# EAGLE design TINRS - Wobbler (third batch) (EAGLE 7.7.0)

## Sheet 1 of 5: MCU & Eeprom
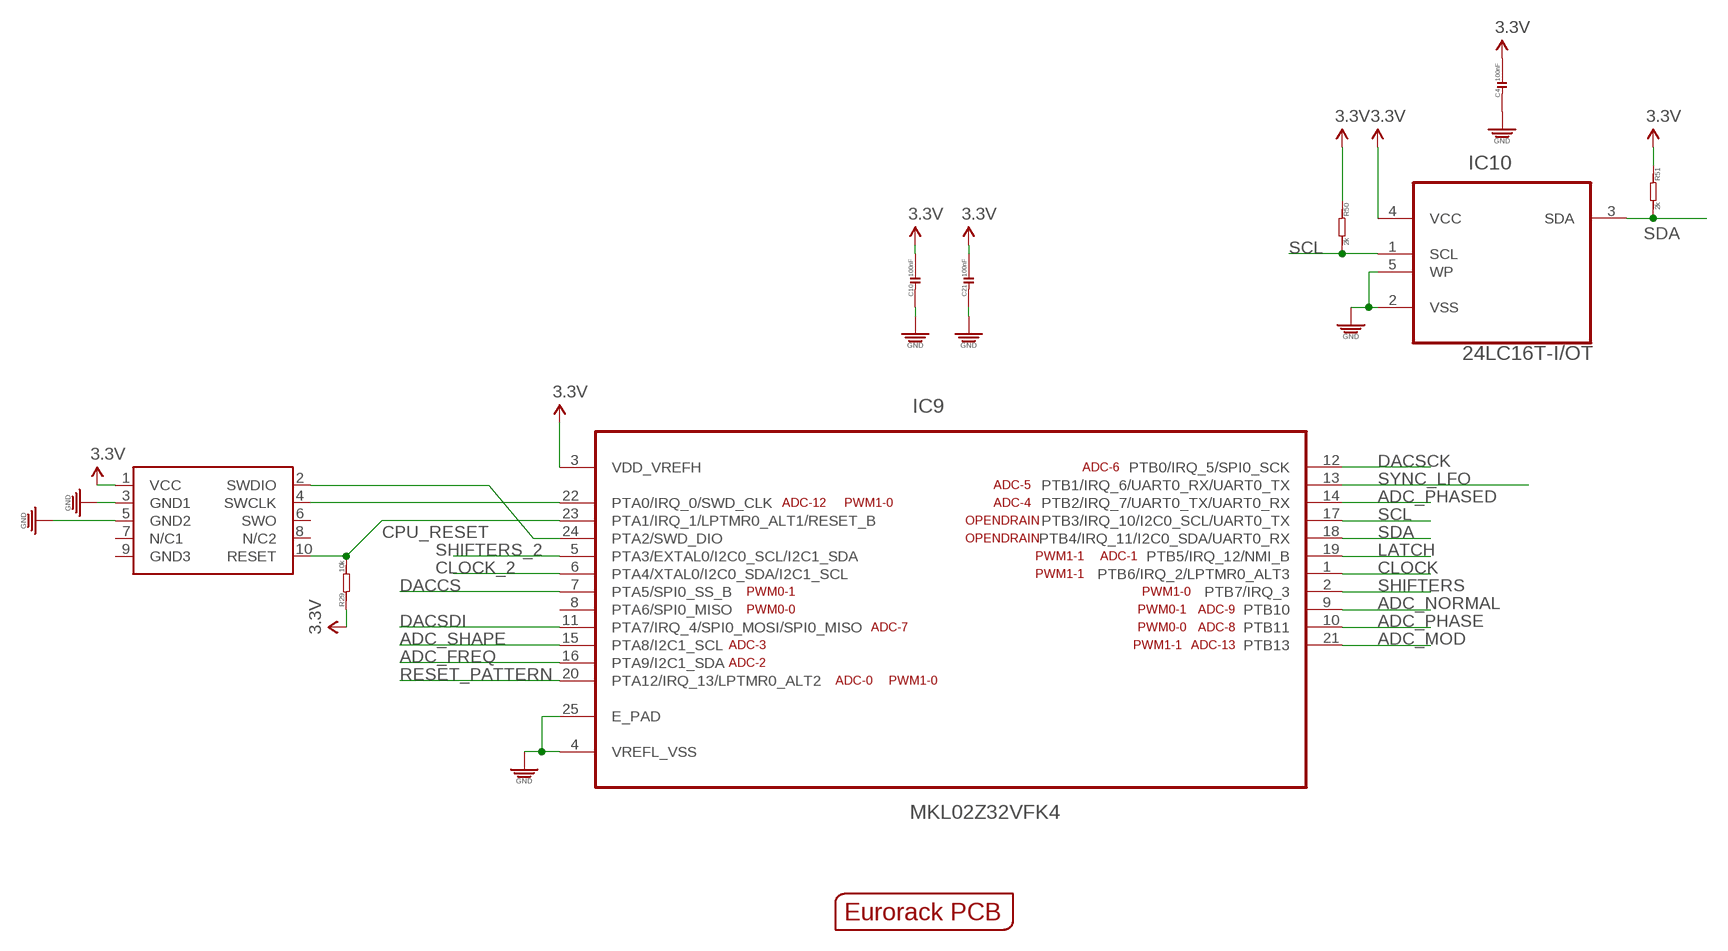
[diagram p0: schematic, sheet 1]

### Parts
C4  100nF  C-0603  [C0603]
C10  100nF  C-0603  [C0603]
C21  100nF  C-0603  [C0603]
IC9  MKL02Z32VFK4  [QFN50P400X400X100-25N]
IC10  24LC16T-I/OT  24LC00T-I/OT  [SOT95P290X145-5N]
OUTLINE  EURORACK_PCB12HP  [EURORACK12HPPCB]
R29  10k  R-0603  [R0603]
R50  2k  R-0603  [R0603]
R51  2k  R-0603  [R0603]
SWD1  CORTEX_SWD  [M50-3600542]

### Nets
3.3V [heavypower]: C4.2 C10.2 C21.2 IC9.3(VDD_VREFH) IC10.4(VCC) R29.1 R50.1 R51.1 SWD1.1(VCC) ; also sheet 2,3,4,5
ADC_FREQ: IC9.16(PTA9/I2C1_SDA) ; also sheet 5
ADC_MOD: IC9.21(PTB13) ; also sheet 5
ADC_NORMAL: IC9.9(PTB10) ; also sheet 5
ADC_PHASE: IC9.10(PTB11) ; also sheet 5
ADC_PHASED: IC9.14(PTB2/IRQ_7/UART0_TX/UART0_RX) ; also sheet 5
ADC_SHAPE: IC9.15(PTA8/I2C1_SCL) ; also sheet 5
CLOCK: IC9.1(PTB6/IRQ_2/LPTMR0_ALT3) ; also sheet 2
CLOCK_2: IC9.6(PTA4/XTAL0/I2C0_SDA/I2C1_SCL) ; also sheet 2
CPU_RESET: IC9.23(PTA1/IRQ_1/LPTMR0_ALT1/RESET_B) R29.2 SWD1.10(RESET)
DACCS: IC9.7(PTA5/SPI0_SS_B) ; also sheet 3
DACSCK: IC9.12(PTB0/IRQ_5/SPI0_SCK) ; also sheet 3
DACSDI: IC9.11(PTA7/IRQ_4/SPI0_MOSI/SPI0_MISO) ; also sheet 3
GND [groundplane]: C4.1 C10.1 C21.1 IC9.4(VREFL_VSS) IC9.25(E_PAD) IC10.2(VSS) IC10.5(WP) SWD1.3(GND1) SWD1.5(GND2) ; also sheet 2,3,4,5
LATCH: IC9.19(PTB5/IRQ_12/NMI_B) ; also sheet 2
RESET_PATTERN: IC9.20(PTA12/IRQ_13/LPTMR0_ALT2) ; also sheet 2,5
SCL: IC9.17(PTB3/IRQ_10/I2C0_SCL/UART0_TX) IC10.1(SCL) R50.2
SDA: IC9.18(PTB4/IRQ_11/I2C0_SDA/UART0_RX) IC10.3(SDA) R51.2
SHIFTERS: IC9.2(PTB7/IRQ_3) ; also sheet 2
SHIFTERS_2: IC9.5(PTA3/EXTAL0/I2C0_SCL/I2C1_SDA) ; also sheet 2
SWD_CLK: IC9.22(PTA0/IRQ_0/SWD_CLK) SWD1.4(SWCLK)
SWD_DIO: IC9.24(PTA2/SWD_DIO) SWD1.2(SWDIO)
SYNC_LFO: IC9.13(PTB1/IRQ_6/UART0_RX/UART0_TX) ; also sheet 5
Unconnected: IC9.8(PTA6/SPI0_MISO) SWD1.6(SWO) SWD1.7(N/C1) SWD1.8(N/C2) SWD1.9(GND3)

## Sheet 2 of 5: LEDs & button
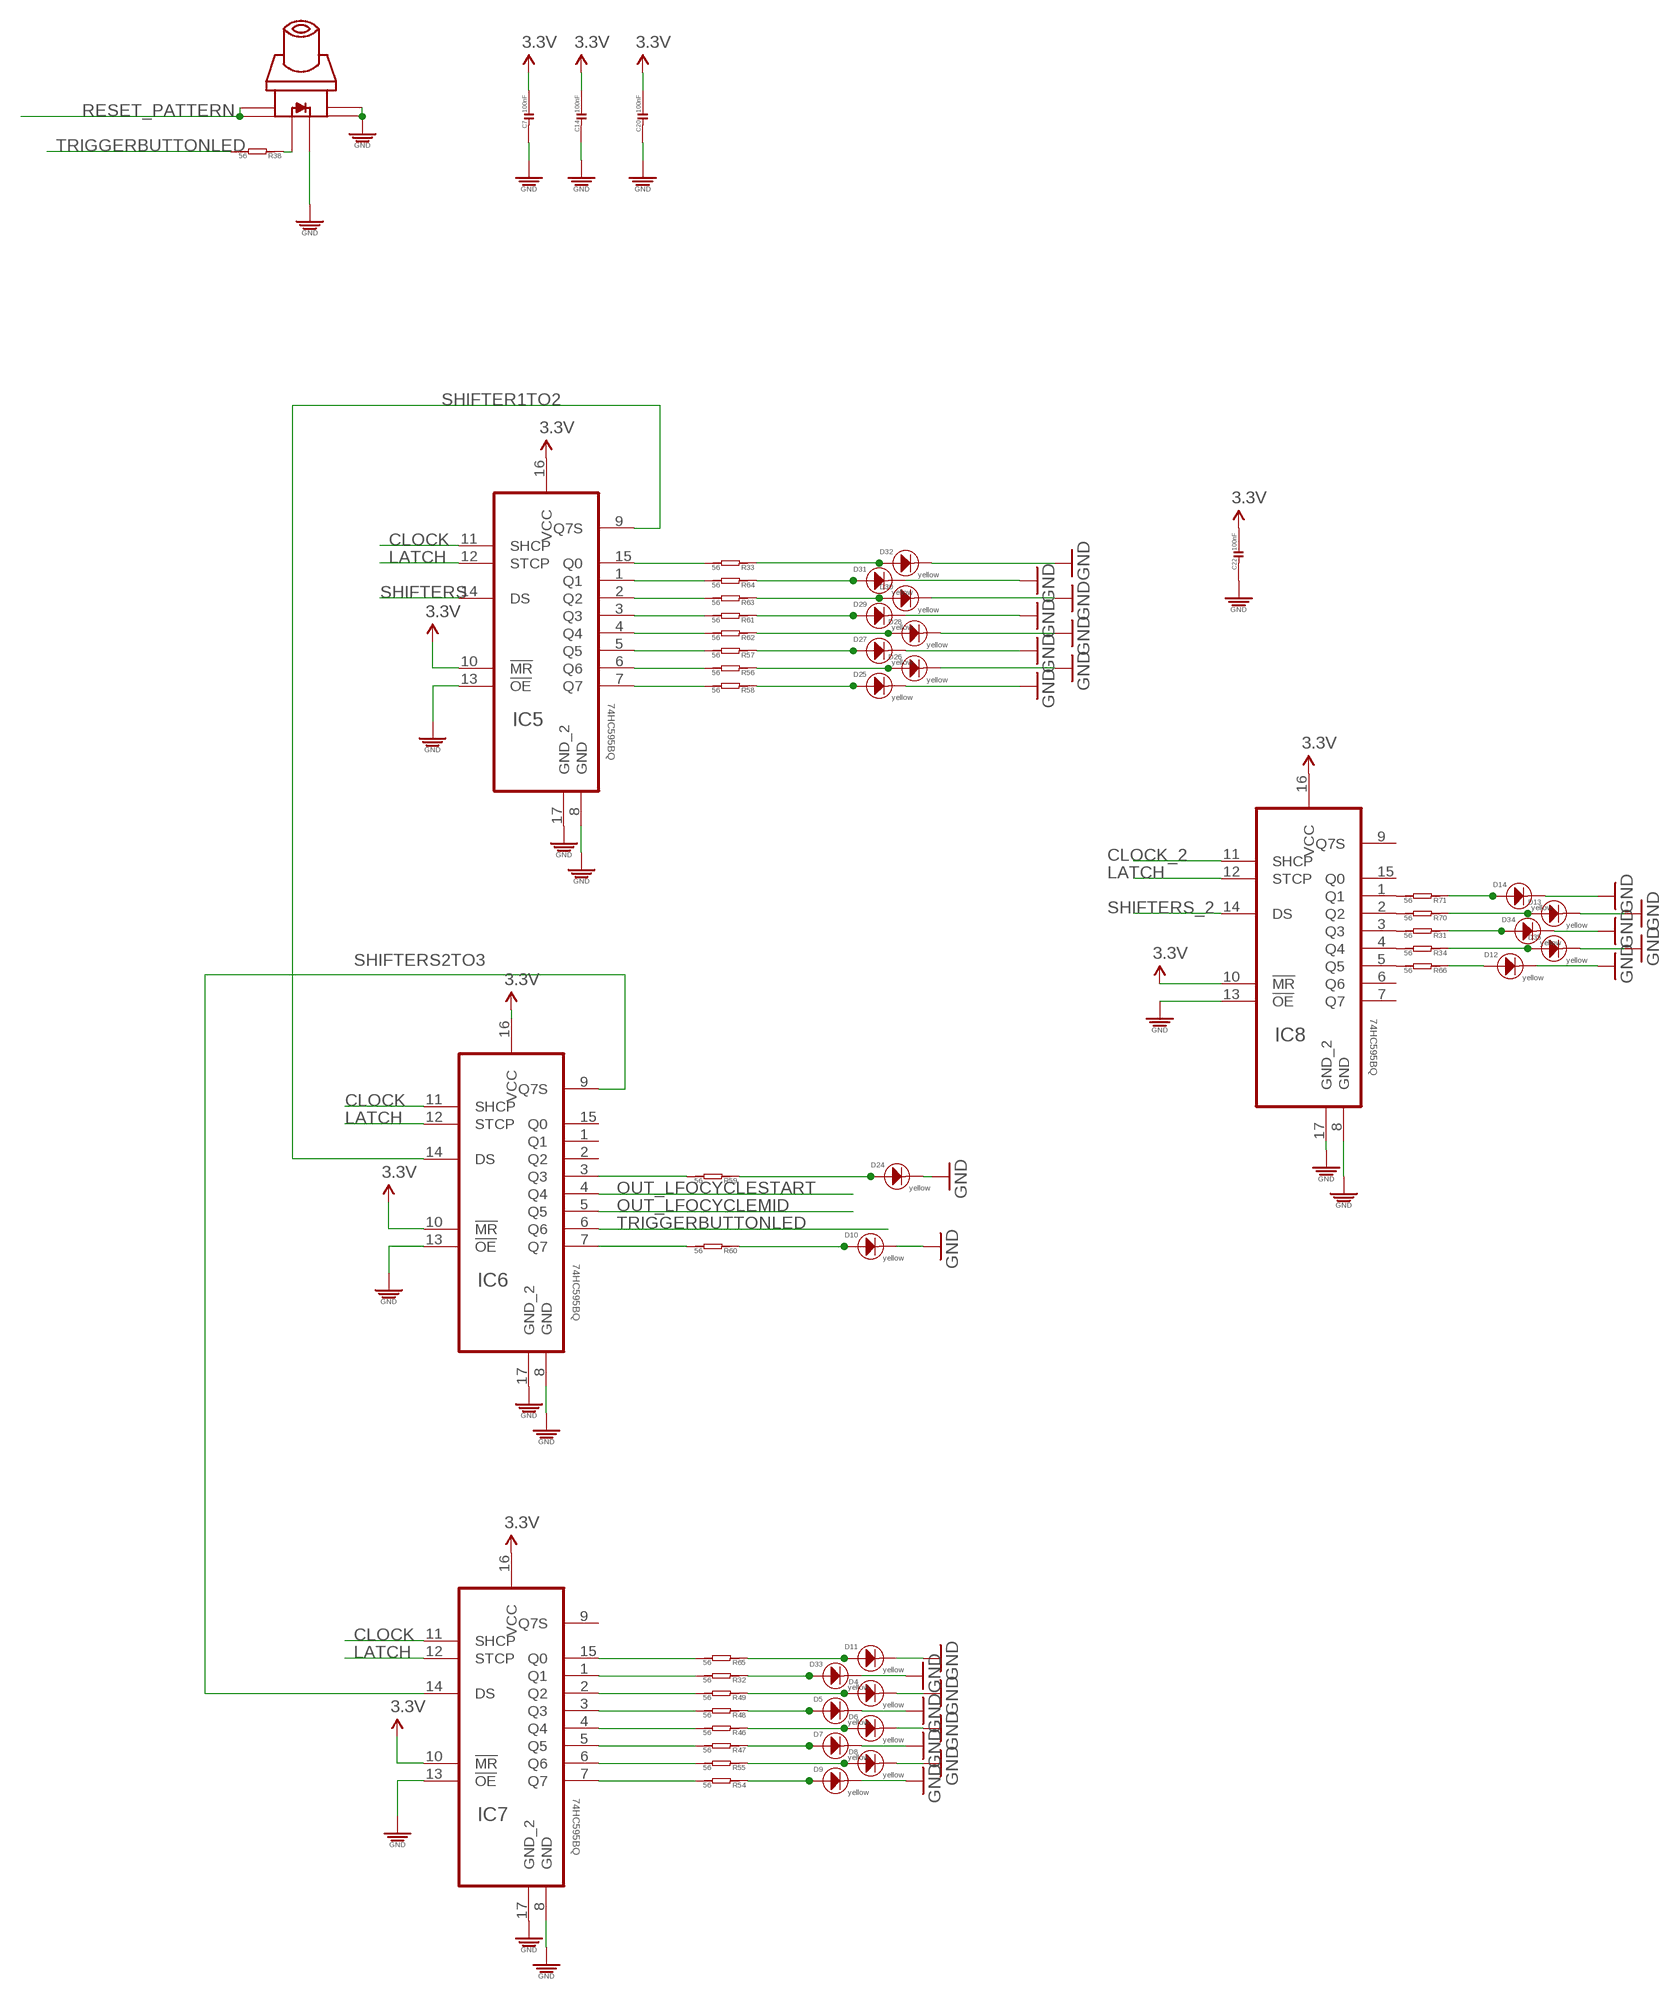
[diagram p1: schematic, sheet 2]

### Parts
C7  100nF  C-0603  [C0603]
C14  100nF  C-0603  [C0603]
C20  100nF  C-0603  [C0603]
C22  100nF  C-0603  [C0603]
D4  yellow  LED3MM  [3MMLED]
D5  yellow  LED3MM  [3MMLED]
D6  yellow  LED3MM  [3MMLED]
D7  yellow  LED3MM  [3MMLED]
D8  yellow  LED3MM  [3MMLED]
D9  yellow  LED3MM  [3MMLED]
D10  yellow  LED3MM  [3MMLED]
D11  yellow  LED3MM  [3MMLED]
D12  yellow  LED3MM  [3MMLED]
D13  yellow  LED3MM  [3MMLED]
D14  yellow  LED3MM  [3MMLED]
D24  yellow  LED3MM  [3MMLED]
D25  yellow  LED3MM  [3MMLED]
D26  yellow  LED3MM  [3MMLED]
D27  yellow  LED3MM  [3MMLED]
D28  yellow  LED3MM  [3MMLED]
D29  yellow  LED3MM  [3MMLED]
D30  yellow  LED3MM  [3MMLED]
D31  yellow  LED3MM  [3MMLED]
D32  yellow  LED3MM  [3MMLED]
D33  yellow  LED3MM  [3MMLED]
D34  yellow  LED3MM  [3MMLED]
D35  yellow  LED3MM  [3MMLED]
IC5  74HC595BQ  [QFN50P250X350X100-17N]
IC6  74HC595BQ  [QFN50P250X350X100-17N]
IC7  74HC595BQ  [QFN50P250X350X100-17N]
IC8  74HC595BQ  [QFN50P250X350X100-17N]
R31  56  R-0603  [R0603]
R32  56  R-0603  [R0603]
R33  56  R-0603  [R0603]
R34  56  R-0603  [R0603]
R38  56  R-0603  [R0603]
R46  56  R-0603  [R0603]
R47  56  R-0603  [R0603]
R48  56  R-0603  [R0603]
R49  56  R-0603  [R0603]
R54  56  R-0603  [R0603]
R55  56  R-0603  [R0603]
R56  56  R-0603  [R0603]
R57  56  R-0603  [R0603]
R58  56  R-0603  [R0603]
R59  56  R-0603  [R0603]
R60  56  R-0603  [R0603]
R61  56  R-0603  [R0603]
R62  56  R-0603  [R0603]
R63  56  R-0603  [R0603]
R64  56  R-0603  [R0603]
R65  56  R-0603  [R0603]
R66  56  R-0603  [R0603]
R70  56  R-0603  [R0603]
R71  56  R-0603  [R0603]
U$1  SWITCH_W_LED_PB6149L-X-102YELLOW  [PB6149L]

### Nets
3.3V [heavypower]: C7.2 C14.2 C20.2 C22.2 IC5.10(!MR) IC5.16(VCC) IC6.10(!MR) IC6.16(VCC) IC7.10(!MR) IC7.16(VCC) IC8.10(!MR) IC8.16(VCC) ; also sheet 1,3,4,5
CLOCK: IC5.11(SHCP) IC6.11(SHCP) IC7.11(SHCP) ; also sheet 1
CLOCK_2: IC8.11(SHCP) ; also sheet 1
GND [groundplane]: C7.1 C14.1 C20.1 C22.1 D4.- D5.- D6.- D7.- D8.- D9.- D10.- D11.- D12.- D13.- D14.- D24.- D25.- D26.- D27.- D28.- D29.- D30.- D31.- D32.- D33.- D34.- D35.- IC5.8(GND) IC5.13(!OE) IC5.17(GND_2) IC6.8(GND) IC6.13(!OE) IC6.17(GND_2) IC7.8(GND) IC7.13(!OE) IC7.17(GND_2) IC8.8(GND) IC8.13(!OE) IC8.17(GND_2) U$1.3 U$1.4 U$1.LEDNEG(NEG) ; also sheet 1,3,4,5
LATCH: IC5.12(STCP) IC6.12(STCP) IC7.12(STCP) IC8.12(STCP) ; also sheet 1
N$1: IC5.15(Q0) R33.2
N$14: D7.+ R47.1
N$19: IC5.1(Q1) R64.2
N$22: IC5.2(Q2) R63.2
N$26: IC5.3(Q3) R61.2
N$28: D28.+ R62.1
N$30: IC5.4(Q4) R62.2
N$31: IC5.5(Q5) R57.2
N$32: D29.+ R61.1
N$35: IC5.6(Q6) R56.2
N$36: IC5.7(Q7) R58.2
N$37: IC6.3(Q3) R59.2
N$38: IC7.7(Q7) R54.2
N$39: IC7.6(Q6) R55.2
N$40: IC7.5(Q5) R47.2
N$41: R38.1 U$1.LEDPOS(POS)
N$42: D13.+ R70.1
N$43: IC7.4(Q4) R46.2
N$46: D6.+ R46.1
N$47: D5.+ R48.1
N$48: D4.+ R49.1
N$49: D8.+ R55.1
N$50: D9.+ R54.1
N$51: D10.+ R60.1
N$52: D11.+ R65.1
N$53: IC7.3(Q3) R48.2
N$54: IC7.2(Q2) R49.2
N$55: IC7.1(Q1) R32.2
N$56: IC7.15(Q0) R65.2
N$57: IC6.7(Q7) R60.2
N$58: D14.+ R71.1
N$59: IC8.1(Q1) R71.2
N$62: IC8.2(Q2) R70.2
N$65: D12.+ R66.1
N$66: IC8.3(Q3) R31.2
N$67: IC8.4(Q4) R34.2
N$68: IC8.5(Q5) R66.2
N$73: D27.+ R57.1
N$74: D26.+ R56.1
N$75: D25.+ R58.1
N$76: D24.+ R59.1
N$77: D30.+ R63.1
N$78: D31.+ R64.1
N$79: D32.+ R33.1
N$80: D33.+ R32.1
N$81: D34.+ R31.1
N$82: D35.+ R34.1
OUT_LFOCYCLEMID: IC6.5(Q5) ; also sheet 3
OUT_LFOCYCLESTART: IC6.4(Q4) ; also sheet 3
RESET_PATTERN: U$1.1 U$1.2 ; also sheet 1,5
SHIFTER1TO2: IC5.9(Q7S) IC6.14(DS)
SHIFTERS: IC5.14(DS) ; also sheet 1
SHIFTERS2TO3: IC6.9(Q7S) IC7.14(DS)
SHIFTERS_2: IC8.14(DS) ; also sheet 1
TRIGGERBUTTONLED: IC6.6(Q6) R38.2
Unconnected: IC6.1(Q1) IC6.2(Q2) IC6.15(Q0) IC7.9(Q7S) IC8.6(Q6) IC8.7(Q7) IC8.9(Q7S) IC8.15(Q0)

## Sheet 3 of 5: DAC & Trigger outs
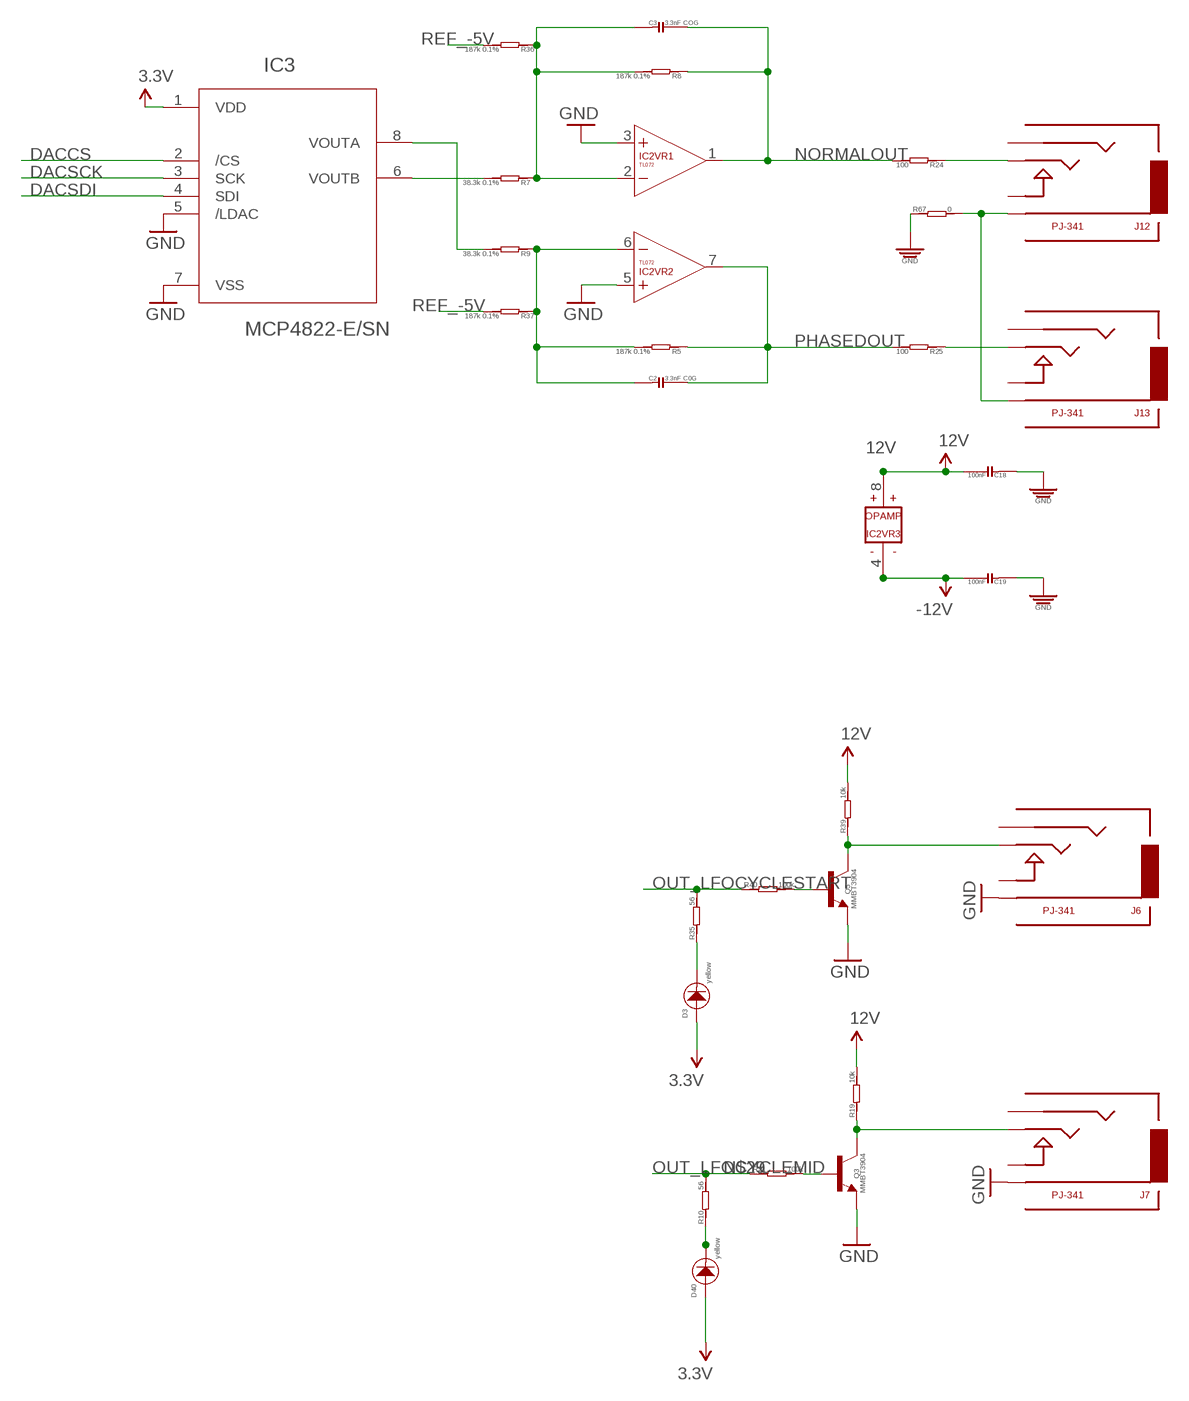
[diagram p2: schematic, sheet 3]

### Parts
C2  3.3nF C0G  C-0603  [C0603]
C3  3.3nF COG  C-0603  [C0603]
C18  100nF  C-0603  [C0603]
C19  100nF  C-0603  [C0603]
D3  yellow  LED3MM  [3MMLED]
D40  yellow  LED3MM  [3MMLED]
IC2  TL072  [SO08]
IC3  MCP4822-E/SN  [SOIC8-N_MC]
J6  PJ-341  AUDIO-JACKOUTPUT  [3.5MM-JACK-SWITCH-13MM-OUTPUT]
J7  PJ-341  AUDIO-JACKOUTPUT  [3.5MM-JACK-SWITCH-13MM-OUTPUT]
J12  PJ-341  AUDIO-JACKOUTPUT  [3.5MM-JACK-SWITCH-13MM-OUTPUT]
J13  PJ-341  AUDIO-JACKOUTPUT  [3.5MM-JACK-SWITCH-13MM-OUTPUT]
Q3  MMBT3904  MMBT3904LT1-NPN-SOT23-BEC  [SOT23-BEC]
Q5  MMBT3904  MMBT3904LT1-NPN-SOT23-BEC  [SOT23-BEC]
R5  187k 0.1%  R-0603  [R0603]
R7  38.3k 0.1%  R-0603  [R0603]
R8  187k 0.1%  R-0603  [R0603]
R9  38.3k 0.1%  R-0603  [R0603]
R10  56  R-0603  [R0603]
R19  10k  R-0603  [R0603]
R21  100k  R-0603  [R0603]
R24  100  R-0603  [R0603]
R25  100  R-0603  [R0603]
R35  56  R-0603  [R0603]
R36  187k 0.1%  R-0603  [R0603]
R37  187k 0.1%  R-0603  [R0603]
R39  10k  R-0603  [R0603]
R40  100k  R-0603  [R0603]
R67  0  R-0603  [R0603]

### Nets
3.3V [heavypower]: D3.+ D40.+ IC3.1(VDD) ; also sheet 1,2,4,5
12V [heavypower]: C18.2 IC2.8(VR3:V+) R19.2 R39.2 ; also sheet 4
-12V [heavypower]: C19.2 IC2.4(VR3:V-) ; also sheet 4
DACCS: IC3.2(/CS) ; also sheet 1
DACSCK: IC3.3(SCK) ; also sheet 1
DACSDI: IC3.4(SDI) ; also sheet 1
GND [groundplane]: C18.1 C19.1 IC2.3(VR1:+IN) IC2.5(VR2:+IN) IC3.5(/LDAC) IC3.7(VSS) J6.RING@3(RING) J7.RING@3(RING) Q3.E Q5.E R67.1 ; also sheet 1,2,4,5
N$5: IC3.8(VOUTA) R9.2
N$7: IC3.6(VOUTB) R7.2
N$9: C2.1 IC2.6(VR2:-IN) R5.2 R9.1 R37.1
N$10: C3.1 IC2.2(VR1:-IN) R7.1 R8.2 R36.1
N$20: J13.TIP@3(TIP) R25.1
N$21: J12.TIP@3(TIP) R24.1
N$23: D40.- R10.1
N$25: Q3.B R21.2
N$27: D3.- R35.1
N$29: J7.TIP@3(TIP) Q3.C R19.1
N$60: Q5.B R40.2
N$61: J6.TIP@3(TIP) Q5.C R39.1
NORMALOUT: C3.2 IC2.1(VR1:OUT) R8.1 R24.2
OUT_LFOCYCLEMID: R10.2 R21.1 ; also sheet 2
OUT_LFOCYCLESTART: R35.2 R40.1 ; also sheet 2
PHASEDOUT: C2.2 IC2.7(VR2:OUT) R5.1 R25.2
REF_-5V: R36.2 R37.2 ; also sheet 4,5
RETURNGROUND [returnground]: J12.RING@3(RING) J13.RING@3(RING) R67.2
Unconnected: J6.SECOND@3(SECOND) J6.SWITCH@3(SWITCH) J7.SECOND@3(SECOND) J7.SWITCH@3(SWITCH) J12.SECOND@3(SECOND) J12.SWITCH@3(SWITCH) J13.SECOND@3(SECOND) J13.SWITCH@3(SWITCH)

## Sheet 4 of 5: Power
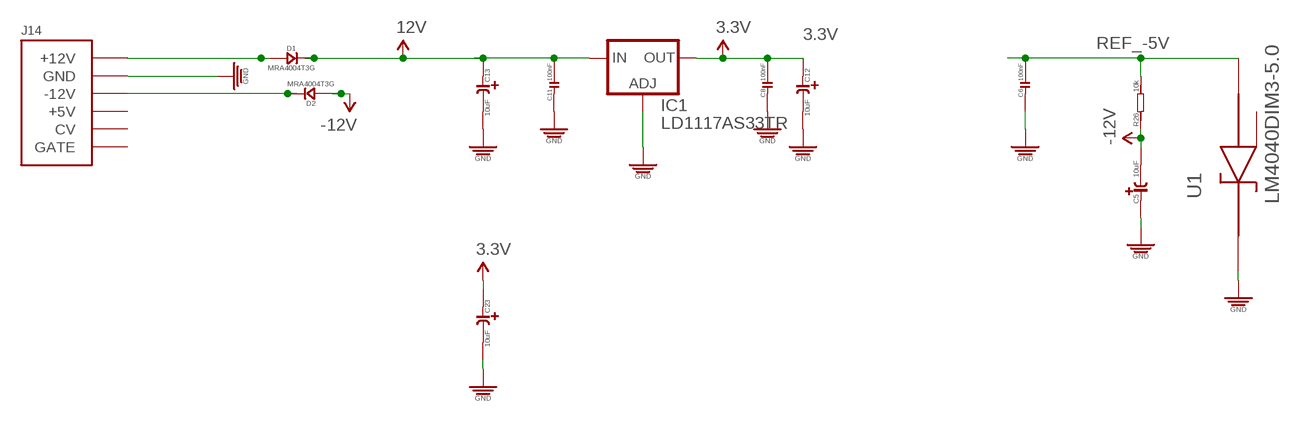
[diagram p3: schematic, sheet 4]

### Parts
C5  10uF  C-POLAR-A  [CASE-A_3216]
C6  100nF  C-0603  [C0603]
C8  100nF  C-0603  [C0603]
C11  100nF  C-0603  [C0603]
C12  10uF  C-POLAR-A  [CASE-A_3216]
C13  10uF  C-POLAR-A  [CASE-A_3216]
C23  10uF  C-POLAR-A  [CASE-A_3216]
D1  MRA4004T3G  D-SMA  [DO-214AC]
D2  MRA4004T3G  D-SMA  [DO-214AC]
IC1  LD1117AS33TR  [SOT223]
J14  POWERSMT  [2X08_SMT_HEADER]
R26  10k  R-0603  [R0603]
U1  LM4040DIM3-5.0  [SOT95P237X112-3N]

### Nets
3.3V [heavypower]: C8.2 C12.+ C23.+ IC1.2(OUT) IC1.4(OUT) ; also sheet 1,2,3,5
12V [heavypower]: C11.2 C13.+ D1.2(-) IC1.3(IN) ; also sheet 3
-12V [heavypower]: C5.- D2.1(+) R26.1 ; also sheet 3
GND [groundplane]: C5.+ C6.1 C8.1 C11.1 C12.- C13.- C23.- IC1.1(ADJ) J14.3(GND) J14.4(GND) J14.5(GND) J14.6(GND) J14.7(GND) J14.8(GND) U1.1(CATHODE) ; also sheet 1,2,3,5
N$13 [heavypower]: D1.1(+) J14.9(+12V) J14.10(+12V)
N$64 [heavypower]: D2.2(-) J14.1(-12V) J14.2(-12V)
REF_-5V: C6.2 R26.2 U1.2(ANODE) ; also sheet 3,5
Unconnected: J14.11(+5V) J14.12(+5V) J14.13(CV) J14.14(CV) J14.15(GATE) J14.16(GATE) U1.3(NC)

## Sheet 5 of 5: Inputs & Knobs
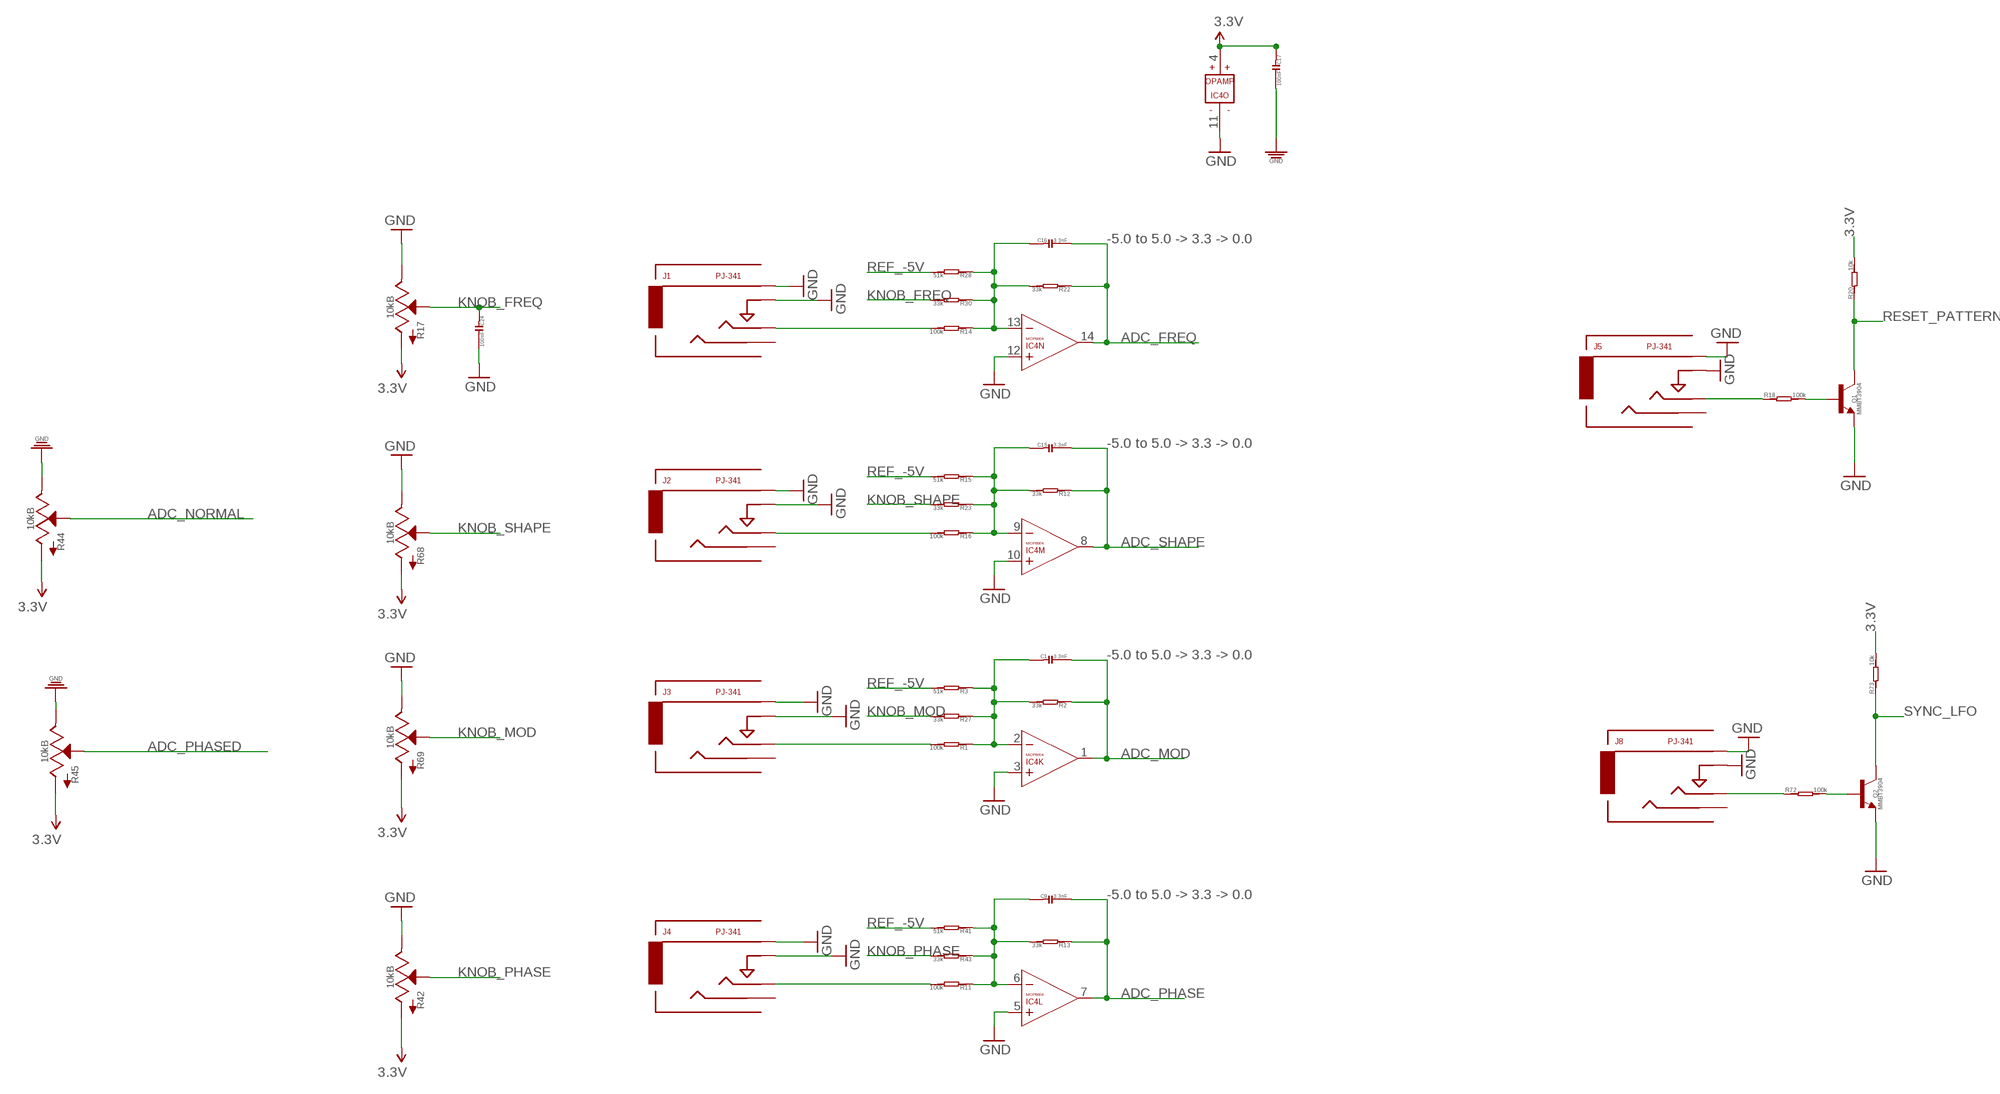
[diagram p4: schematic, sheet 5]

### Parts
C1  3.3nF  C-0603  [C0603]
C9  3.3nF  C-0603  [C0603]
C15  3.3nF  C-0603  [C0603]
C16  3.3nF  C-0603  [C0603]
C17  100nF  C-0603  [C0603]
C24  100nF  C-0603  [C0603]
IC4  MCP6004  [SO14]
J1  PJ-341  AUDIO-JACKINPUT  [3.5MM-JACK-SWITCH-13MM-INPUT]
J2  PJ-341  AUDIO-JACKINPUT  [3.5MM-JACK-SWITCH-13MM-INPUT]
J3  PJ-341  AUDIO-JACKINPUT  [3.5MM-JACK-SWITCH-13MM-INPUT]
J4  PJ-341  AUDIO-JACKINPUT  [3.5MM-JACK-SWITCH-13MM-INPUT]
J5  PJ-341  AUDIO-JACKINPUT  [3.5MM-JACK-SWITCH-13MM-INPUT]
J8  PJ-341  AUDIO-JACKINPUT  [3.5MM-JACK-SWITCH-13MM-INPUT]
Q1  MMBT3904  MMBT3904LT1-NPN-SOT23-BEC  [SOT23-BEC]
Q2  MMBT3904  MMBT3904LT1-NPN-SOT23-BEC  [SOT23-BEC]
R1  100k  R-0603  [R0603]
R2  33k  R-0603  [R0603]
R3  51k  R-0603  [R0603]
R11  100k  R-0603  [R0603]
R12  33k  R-0603  [R0603]
R13  33k  R-0603  [R0603]
R14  100k  R-0603  [R0603]
R15  51k  R-0603  [R0603]
R16  100k  R-0603  [R0603]
R17  10kB  POTSQUAREHOLE_SMALLKNOB  [ALPS_POT_SQUAREHOLES]
R18  100k  R-0603  [R0603]
R20  10k  R-0603  [R0603]
R22  33k  R-0603  [R0603]
R23  33k  R-0603  [R0603]
R27  33k  R-0603  [R0603]
R28  51k  R-0603  [R0603]
R30  33k  R-0603  [R0603]
R41  51k  R-0603  [R0603]
R42  10kB  POTSQUAREHOLE_SMALLKNOB  [ALPS_POT_SQUAREHOLES]
R43  33k  R-0603  [R0603]
R44  10kB  POTSQUAREHOLE_SMALLKNOB  [ALPS_POT_SQUAREHOLES]
R45  10kB  POTSQUAREHOLE_SMALLKNOB  [ALPS_POT_SQUAREHOLES]
R68  10kB  POTSQUAREHOLE_SMALLKNOB  [ALPS_POT_SQUAREHOLES]
R69  10kB  POTSQUAREHOLE_SMALLKNOB  [ALPS_POT_SQUAREHOLES]
R72  100k  R-0603  [R0603]
R73  10k  R-0603  [R0603]

### Nets
3.3V [heavypower]: C17.1 IC4.4(O:V+) R17.P$3(A) R20.2 R42.P$3(A) R44.P$3(A) R45.P$3(A) R68.P$3(A) R69.P$3(A) R73.2 ; also sheet 1,2,3,4
ADC_FREQ: C16.2 IC4.14(N:OUT) R22.1 ; also sheet 1
ADC_MOD: C1.2 IC4.1(K:OUT) R2.1 ; also sheet 1
ADC_NORMAL: R44.P$2(S) ; also sheet 1
ADC_PHASE: C9.2 IC4.7(L:OUT) R13.1 ; also sheet 1
ADC_PHASED: R45.P$2(S) ; also sheet 1
ADC_SHAPE: C15.2 IC4.8(M:OUT) R12.1 ; also sheet 1
GND [groundplane]: C17.2 C24.2 IC4.3(K:+IN) IC4.5(L:+IN) IC4.10(M:+IN) IC4.11(O:V-) IC4.12(N:+IN) J1.RING@3(RING) J1.SWITCH@3(SWITCH) J2.RING@3(RING) J2.SWITCH@3(SWITCH) J3.RING@3(RING) J3.SWITCH@3(SWITCH) J4.RING@3(RING) J4.SWITCH@3(SWITCH) J5.RING@3(RING) J5.SWITCH@3(SWITCH) J8.RING@3(RING) J8.SWITCH@3(SWITCH) Q1.E Q2.E R17.P$1(E) R42.P$1(E) R44.P$1(E) R45.P$1(E) R68.P$1(E) R69.P$1(E) ; also sheet 1,2,3,4
KNOB_FREQ: C24.1 R17.P$2(S) R30.2
KNOB_MOD: R27.2 R69.P$2(S)
KNOB_PHASE: R42.P$2(S) R43.2
KNOB_SHAPE: R23.2 R68.P$2(S)
N$3: J2.TIP@3(TIP) R16.2
N$4: C15.1 IC4.9(M:-IN) R12.2 R15.1 R16.1 R23.1
N$6: J3.TIP@3(TIP) R1.2
N$8: C1.1 IC4.2(K:-IN) R1.1 R2.2 R3.1 R27.1
N$11: J4.TIP@3(TIP) R11.2
N$12: C9.1 IC4.6(L:-IN) R11.1 R13.2 R41.1 R43.1
N$15: Q1.B R18.2
N$16: J5.TIP@3(TIP) R18.1
N$33: J1.TIP@3(TIP) R14.2
N$34: C16.1 IC4.13(N:-IN) R14.1 R22.2 R28.1 R30.1
N$44: Q2.B R72.2
N$45: J8.TIP@3(TIP) R72.1
REF_-5V: R3.2 R15.2 R28.2 R41.2 ; also sheet 3,4
RESET_PATTERN: Q1.C R20.1 ; also sheet 1,2
SYNC_LFO: Q2.C R73.1 ; also sheet 1
Unconnected: J1.SECOND@3(SECOND) J2.SECOND@3(SECOND) J3.SECOND@3(SECOND) J4.SECOND@3(SECOND) J5.SECOND@3(SECOND) J8.SECOND@3(SECOND)

### Notes on the sheet
- -5.0 to 5.0 -> 3.3 -> 0.0
- -5.0 to 5.0 -> 3.3 -> 0.0
- -5.0 to 5.0 -> 3.3 -> 0.0
- -5.0 to 5.0 -> 3.3 -> 0.0

## Library data of the parts
C1-C3 C9 C15 C16 = OPL:C*; OC_FARNELL: unknown
C4 C7 C8 C10 C11 C14 C17-C22 C24 = OPL:C*; MF: MULTICOMP; MPN: MC0603F104Z160CT; OC_FARNELL: 1759017
C5 C12 C13 C23 = EurorackModularParts:C-POLAR*; MF: AVX; MPN: TAJB106K020RNJ; OC_FARNELL: 197427
C6 = OPL:C*; MF: AVX; MPN: 06035C104KAT2A; OC_FARNELL: 1301804
D1 D2 = OPL:D*: DIODE; MF: VISHAY; MPN: US1G-E3/5AT; OC_FARNELL: 9551824
D3-D14 D24-D35 D40 = EurorackModularParts:LED*: LED
IC1 = ld-components:LD1117A?*: Low drop fixed and adjustable positive voltage regulators 1 A Source: http://www.st.com/stonline/products/literature/ds/7194/ld1117axx.pdf; MF: STMICROELECTRONICS; MPN: LD1117AS33TR; OC_FARNELL: 1467776
IC2 = EurorackModularParts:TL072
IC3 = FarnellThings:MCP4822-E/SN: 12 Bit DAC; DESCRIPTION: 12 Bit DAC; MF: MICROCHIP; MPN: MCP4822-E/SN; OC_FARNELL: 1439414; OC_NEWARK: 31K2975; PACKAGE: SOIC-8; SUPPLIER: Microchip
IC4 = EurorackModularParts:MCP6004; MF: MICROCHIP; MPN: MCP6004-I/SL.; OC_FARNELL: 1605572
IC5-IC8 = FarnellThings:74HC595BQ: 8-bit serial-in, serial or parallel-out shift register,QFN-16; MF: NXP; MPN: 74HC595BQ; OC_FARNELL: 2164850; OC_NEWARK: 43W8000; PACKAGE: QFN-16; SUPPLIER: NXP
IC9 = FarnellThings:MKL02Z32VFK4: IC, MCU, 32BIT, CORTEX M0+, 48MHZ, QFN-24; MF: NXP; MPN: MKL02Z32VFK4; OC_FARNELL: 2321481; OC_NEWARK: 61W9887; PACKAGE: QFN-24; SUPPLIER: FREESCALE SEMICONDUCTOR
IC10 = EurorackModularParts:24LC00T-I/OT: IC, EEPROM 128BIT SERIAL 400KHZ SOT-23-5; MF: MICROCHIP; MPN: 24LC00T-I/OT; OC_FARNELL: 9757864; OC_NEWARK: 62K0574; PACKAGE: SOT-23-5; SUPPLIER: MICROCHIP
J1 = EurorackModularParts:AUDIO-JACK: Switching Mono 3.5mm Audio Jack from Erthenvar.; DESC: Frequency; OC_FARNELL: unknown
J2 = EurorackModularParts:AUDIO-JACK: Switching Mono 3.5mm Audio Jack from Erthenvar.; DESC: Shape; OC_FARNELL: unknown
J3 = EurorackModularParts:AUDIO-JACK: Switching Mono 3.5mm Audio Jack from Erthenvar.; DESC: Mod; OC_FARNELL: unknown
J4 = EurorackModularParts:AUDIO-JACK: Switching Mono 3.5mm Audio Jack from Erthenvar.; DESC: Phase; OC_FARNELL: unknown
J5 = EurorackModularParts:AUDIO-JACK: Switching Mono 3.5mm Audio Jack from Erthenvar.; DESC: Reset; OC_FARNELL: unknown
J6 = EurorackModularParts:AUDIO-JACK: Switching Mono 3.5mm Audio Jack from Erthenvar.; DESC: Loop; OC_FARNELL: unknown
J7 = EurorackModularParts:AUDIO-JACK: Switching Mono 3.5mm Audio Jack from Erthenvar.; DESC: Mid; OC_FARNELL: unknown
J8 = EurorackModularParts:AUDIO-JACK: Switching Mono 3.5mm Audio Jack from Erthenvar.; DESC: Sync; OC_FARNELL: unknown
J12 = EurorackModularParts:AUDIO-JACK: Switching Mono 3.5mm Audio Jack from Erthenvar.; DESC: Normal Out; OC_FARNELL: unknown
J13 = EurorackModularParts:AUDIO-JACK: Switching Mono 3.5mm Audio Jack from Erthenvar.; DESC: Phased Out; OC_FARNELL: unknown
J14 = EurorackModularParts:POWER; OC_FARNELL: unknown
OUTLINE = EurorackModularParts:EURORACK_PCB; OC_FARNELL: unknown
Q1-Q3 Q5 = transistor:*-NPN-: NPN Transistror BF959 corrected 2008.03.06; MF: NXP; MPN: PMBT3904,215; OC_FARNELL: 2336795
R1-R3 R5 R7-R16 R18-R41 R43 R46-R51 R54-R67 R70-R73 = OPL:R*; OC_FARNELL: unknown
R17 R42 R44 R45 R68 R69 = EurorackModularParts:POT; OC_FARNELL: unknown
SWD1 = carrilib with jtags:CORTEX_SWD: .05" Cortex M Connector in SWD mode Manufacturer: Generic Part Number: Cortex M SWD Notes: I use Harwin M50-3600542 connectors; OC_FARNELL: unknown
U1 = FarnellThings:LM4040DIM3-5.0: IC, Precision Micropower Shunt Voltage Reference, 5V,SOT-23-3; MF: TEXAS INSTRUMENTS; MPN: LM4040DIM3-5.0; OC_FARNELL: 9778330; OC_NEWARK: 97K3489; PACKAGE: SOT-23-3; SUPPLIER: TEXAS INSTRUMENTS
U$1 = zephod-components:SWITCH_W_LED_PB6149L-X-102

## Net classes
0 default: width 0.203 mm, clearance 0.178 mm
1 heavypower: width 0.305 mm
2 mediumpower: width 0.254 mm
3 groundplane: width 0.203 mm, clearance 0.203 mm
4 returnground: width 0.356 mm

## Board
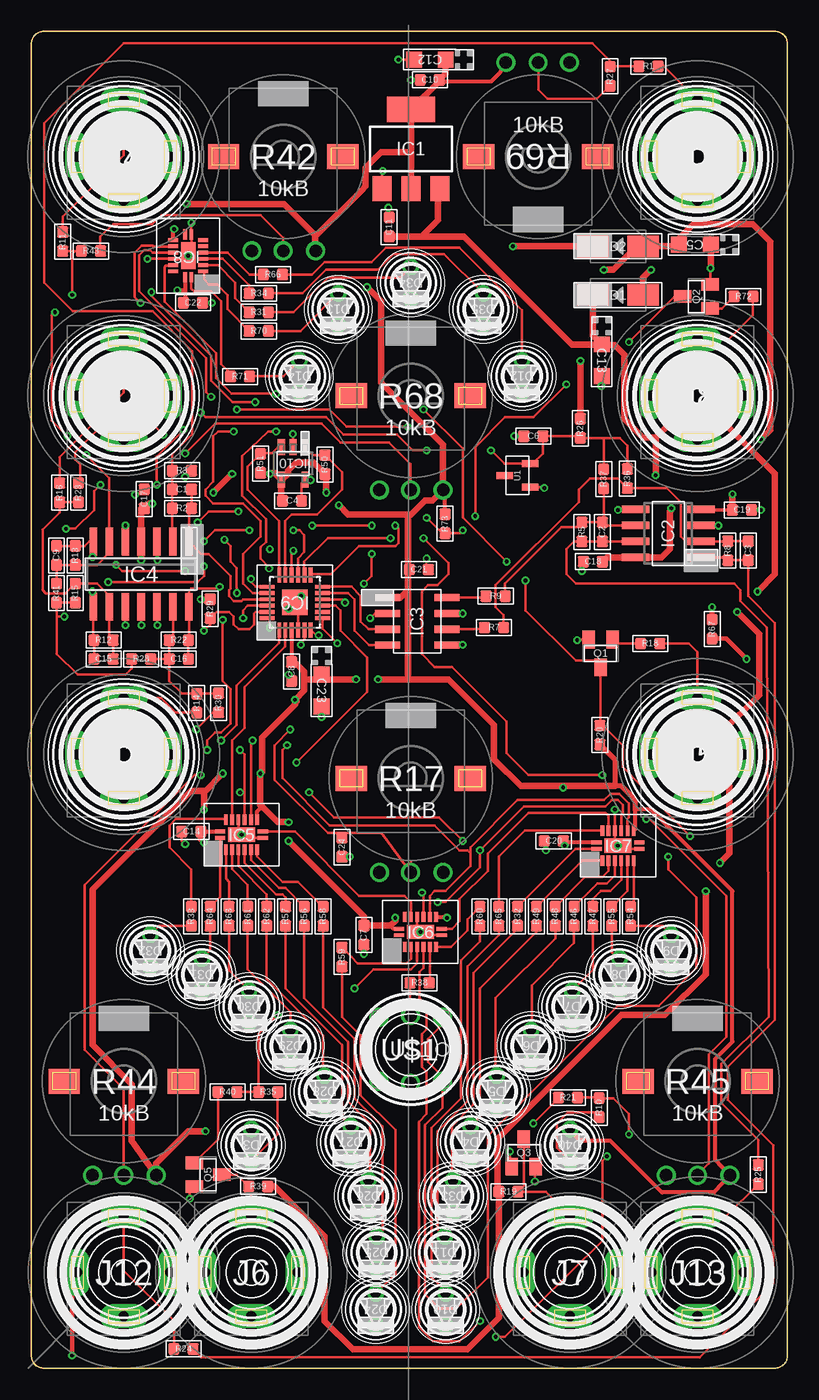
[diagram p5: board, top side]
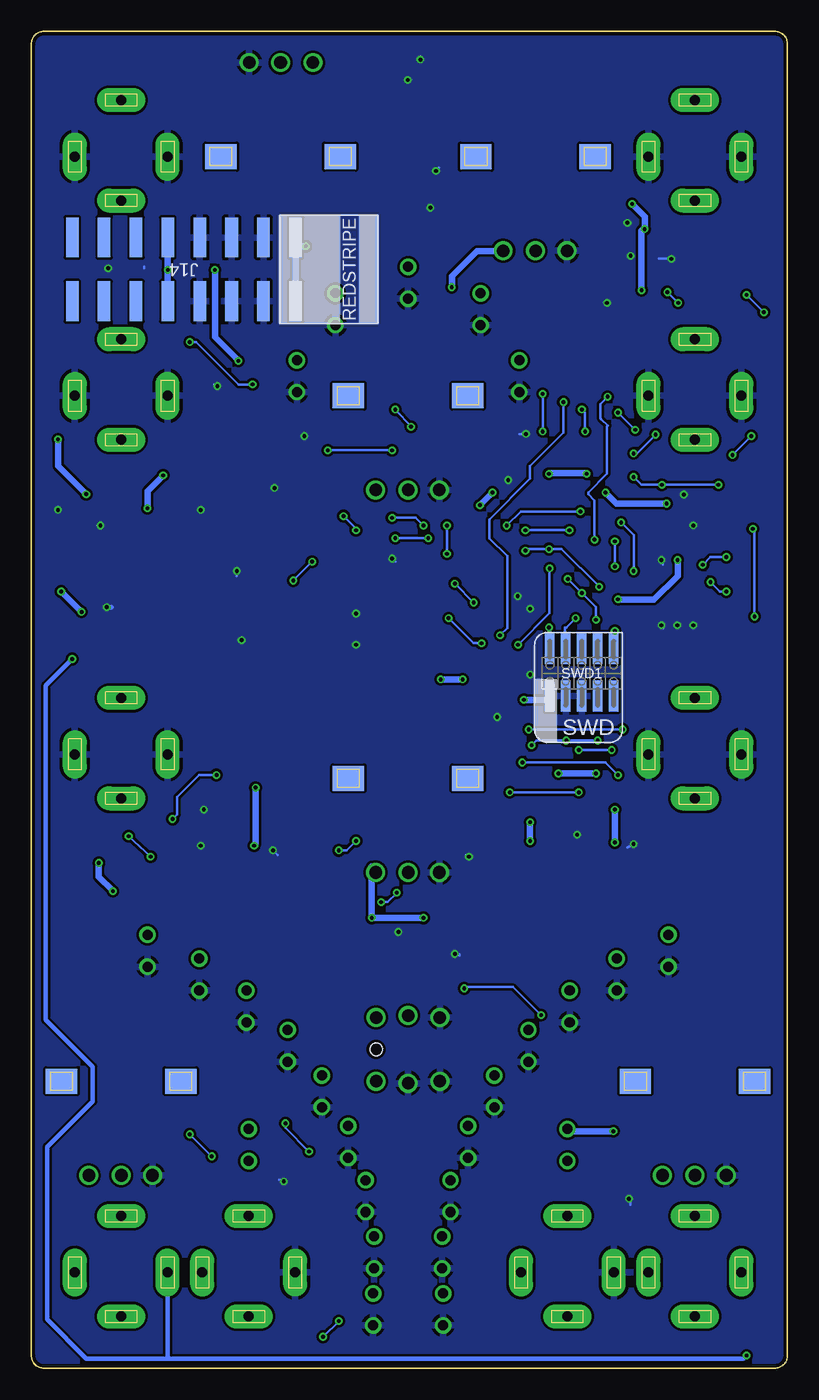
[diagram p6: board, bottom side, seen from below]

Size 60.25 x 106.5 mm. Coordinates in mm from the lower left corner, seen from the top.
Copper layers (1*16): Top 0.035mm / dielectric 1.5mm / Bottom 0.035mm
Design rules "dirt_cheap_dirty_boards.v1": minimum track width 5mil, minimum drill 12mil, track to track 5mil, track to pad 5mil, pad to pad 5mil, via to via 5mil, smd to smd 0mil, copper to edge 10mil, drill to drill 10mil, minimum pad ring 10mil, minimum via ring 6mil, stop-mask expansion 2mil, vias tented up to drill 25mil, thermal gap 10mil

### Footprints (pad centres in the part's own frame; a part is rotated, then mirrored left to right if it is on the bottom)
C0603 = smd 0.889 x 0.889: 1 -0.762,0; 2 0.762,0
CASE-A_3216 = smd 1.27 x 1.27: + -1.27,0; - 1.27,0
DO-214AC = smd 2.5 x 1.7: 1 -2,0; 2 2,0
3MMLED = drill 0.8: + -1.27,0; - 1.27,0
SOT223 = smd 1.5 x 2: 1 -2.3,-3.15; 2 0,-3.15; 3 2.3,-3.15 | smd 3.8 x 2: 4 0,3.15
SO08 = smd 0.6 x 2.2: 1 -1.905,-2.6; 2 -0.635,-2.6; 3 0.635,-2.6; 4 1.905,-2.6; 5 1.905,2.6; 6 0.635,2.6; 7 -0.635,2.6; 8 -1.905,2.6
SOIC8-N_MC = smd 1.981 x 0.559: 1 -2.362,1.905; 2 -2.362,0.635; 3 -2.362,-0.635; 4 -2.362,-1.905; 5 2.362,-1.905; 6 2.362,-0.635; 7 2.362,0.635; 8 2.362,1.905
SO14 = smd 0.6 x 2.2: 1 -3.81,-2.6; 2 -2.54,-2.6; 3 -1.27,-2.6; 4 0,-2.6; 5 1.27,-2.6; 6 2.54,-2.6; 7 3.81,-2.6; 8 3.81,2.6; 9 2.54,2.6; 10 1.27,2.6; 11 0,2.6; 12 -1.27,2.6; 13 -2.54,2.6; 14 -3.81,2.6
QFN50P250X350X100-17N = smd 0.305 x 0.813: 1 -0.254,1.702; 8 -0.254,-1.702; 9 0.254,-1.702; 16 0.254,1.702 | smd 0.813 x 0.305: 2 -1.194,1.245; 3 -1.194,0.762; 4 -1.194,0.254; 5 -1.194,-0.254; 6 -1.194,-0.762; 7 -1.194,-1.245; 10 1.194,-1.245; 11 1.194,-0.762; 12 1.194,-0.254; 13 1.194,0.254; 14 1.194,0.762; 15 1.194,1.245 | smd 1.143 x 2.159: 17 0,0
QFN50P400X400X100-25N = smd 1.2 x 0.3: 1 -2.2,1.245; 2 -2.2,0.762; 3 -2.2,0.254; 4 -2.2,-0.254; 5 -2.2,-0.762; 6 -2.2,-1.245; 13 2.2,-1.245; 14 2.2,-0.762; 15 2.2,-0.254; 16 2.2,0.254; 17 2.2,0.762; 18 2.2,1.245 | smd 0.3 x 1.2: 7 -1.245,-2.2; 8 -0.762,-2.2; 9 -0.254,-2.2; 10 0.254,-2.2; 11 0.762,-2.2; 12 1.245,-2.2; 19 1.245,2.2; 20 0.762,2.2; 21 0.254,2.2; 22 -0.254,2.2 | smd 0.305 x 1.2: 23 -0.762,2.2; 24 -1.245,2.2 | smd 2.032 x 2.032: 25 0,0
SOT95P290X145-5N = smd 1.27 x 0.559: 1 -1.295,0.94; 2 -1.295,0; 3 -1.295,-0.94; 4 1.295,-0.94; 5 1.295,0.94
3.5MM-JACK-SWITCH-13MM-INPUT = drill 0.8 pad 1.93 long: RING@3 -3.7,0; SECOND@3 0,-3.5; SWITCH@3 3.7,0; TIP@3 0,4.5
3.5MM-JACK-SWITCH-13MM-OUTPUT = drill 0.8 pad 1.93 long: RING@3 -3.7,0; SECOND@3 0,-3.5; SWITCH@3 3.7,0; TIP@3 0,4.5
2X08_SMT_HEADER = smd 1 x 3.17: 1 -8.89,-2.54; 2 -8.89,2.54; 3 -6.35,-2.54; 4 -6.35,2.54; 5 -3.81,-2.54; 6 -3.81,2.54; 7 -1.27,-2.54; 8 -1.27,2.54; 9 1.27,-2.54; 10 1.27,2.54; 11 3.81,-2.54; 12 3.81,2.54; 13 6.35,-2.54; 14 6.35,2.54; 15 8.89,-2.54; 16 8.89,2.54
SOT23-BEC = smd 1 x 1.4: B -0.95,-1.1; C 0,1.1; E 0.95,-1.1
R0603 = smd 0.889 x 0.889: 1 -0.762,0; 2 0.762,0
ALPS_POT_SQUAREHOLES = drill 1: P$1 -2.5,-7.5; P$2 0,-7.5; P$3 2.58,-7.5 | smd 2.5 x 2: P$4 -4.75,0; P$5 4.75,0 | smd 2.5 x 2 bottom: P$6 -4.75,0; P$7 4.75,0
M50-3600542 = smd 0.75 x 2.5: 1 -2.54,-1.81; 2 -2.54,2; 3 -1.27,-1.81; 4 -1.27,2; 5 0,-1.81; 6 0,2; 7 1.27,-1.81; 8 1.27,2; 9 2.54,-1.81; 10 2.54,2
SOT95P237X112-3N = smd 1.321 x 0.559: 1 -1.016,0.94; 2 -1.016,-0.94; 3 1.016,0
PB6149L = drill 1: 1 2.54,2.54; 2 2.54,-2.54; 3 -2.54,2.54; 4 -2.54,-2.54; LEDNEG 0,-2.7; LEDPOS 0,2.7 | hole 1: 2.54,0

### Placement (x,y rotation side)
C1  12,70 0 top
C2  45.5,66.62 270 top
C3  57.12,65.12 270 top
C4  20.77,69.1 180 top
C5  52.88,89.5 180 top
C6  40,74.25 0 top
C7  26.5,34.5 90 top
C8  20.75,55.5 90 top
C9  2,64.75 90 top
C10  31.75,102.64 0 top
C11  28.52,90.91 270 top
C12  31.75,104.25 180 top
C13  45.45,80.29 270 top
C14  12.75,42.75 0 top
C15  5.75,56.5 180 top
C16  11.75,56.5 0 top
C17  9,69.25 90 top
C18  44.75,64.25 0 top
C19  56.62,68.38 180 top
C20  41.62,42 0 top
C21  30.88,63.62 180 top
C22  12.88,84.88 180 top
C23  23.12,54 270 top
C24  24.75,41.5 270 top
D1  46.75,85.5 180 top
D2  46.75,89.38 180 top
D3  17.53,17.78 270 top
D4  35.01,18.02 270 top
D5  37.1,22.05 270 top
D6  39.82,25.68 270 top
D7  43.11,28.81 270 top
D8  46.86,31.36 270 top
D9  50.99,33.25 270 top
D10  33.02,4.68 270 top
D11  32.94,9.21 270 top
D12  39.09,79.03 270 top
D13  24.44,84.36 270 top
D14  21.37,79.03 270 top
D24  27.44,4.68 270 top
D25  27.52,9.21 270 top
D26  26.85,13.7 270 top
D27  25.45,18.02 270 top
D28  23.36,22.05 270 top
D29  20.64,25.68 270 top
D30  17.35,28.81 270 top
D31  13.6,31.36 270 top
D32  9.47,33.25 270 top
D33  33.61,13.7 270 top
D34  30.23,86.47 270 top
D35  36.02,84.36 270 top
D40  42.93,17.78 270 top
IC1  30.25,97.13 0 top
IC2  50.75,66.5 90 top
IC3  30.75,59.5 0 top
IC4  8.75,63.25 180 top
IC5  16.75,42.5 90 top
IC6  31,34.75 90 top
IC7  46.75,41.62 90 top
IC8  12.5,88.62 180 top
IC9  21,61 90 top
IC10  20.86,72.08 270 top
J1  7.37,48.9 0 top
J2  7.37,77.47 0 top
J3  53.09,96.52 0 top
J4  7.37,96.52 0 top
J5  53.09,48.9 0 top
J6  17.53,7.62 0 top
J7  42.93,7.62 0 top
J8  53.09,77.47 0 top
J12  7.37,7.62 0 top
J13  53.09,7.62 0 top
J14  48.1,87.54 180 bottom
OUTLINE  -0.25,0 0 top
Q1  45.36,56.95 180 top
Q2  53,85.38 90 top
Q3  39.24,17.16 0 top
Q5  14.08,15.4 270 top
R1  49.18,103.71 0 top
R2  12,68.5 180 top
R3  12,71.5 0 top
R5  43.88,66.62 90 top
R7  36.88,59 180 top
R8  55.5,65.12 90 top
R9  37,61.5 180 top
R10  45.25,20.75 90 top
R11  2.5,89.75 90 top
R12  5.75,58 0 top
R13  3.5,64.75 270 top
R14  13.19,52.98 270 top
R15  3.5,61.75 270 top
R16  2.25,69.75 90 top
R17  30.23,46.99 0 top
R18  49.32,57.73 180 top
R19  38.02,14.05 180 top
R20  45.31,50.44 270 top
R21  42.76,21.55 180 top
R22  11.75,58 180 top
R23  3.75,69.75 90 top
R24  12.12,1.53 0 top
R25  57.93,15.42 90 top
R26  43.75,74.88 270 top
R27  46.12,102.92 270 top
R28  8.75,56.5 180 top
R29  14.25,60.5 270 top
R30  14.91,53 270 top
R31  18.12,84.12 180 top
R32  38.75,36 90 top
R33  12.75,36 90 top
R34  18.12,85.62 180 top
R35  18.88,22 180 top
R36  47.5,70.88 90 top
R37  45.61,70.84 90 top
R38  30.93,30.7 0 top
R39  18.07,14.47 0 top
R40  15.62,22 180 top
R41  2,61.75 270 top
R42  20.07,96.52 0 top
R43  4.75,89 0 top
R44  7.37,22.86 0 top
R45  53.09,22.86 0 top
R46  43.25,36 90 top
R47  44.75,36 90 top
R48  41.75,36 90 top
R49  40.25,36 90 top
R50  23.39,71.98 90 top
R51  18.25,72.08 90 top
R54  47.75,36 90 top
R55  46.25,36 90 top
R56  21.75,36 90 top
R57  20.25,36 90 top
R58  23.25,36 90 top
R59  24.75,32.75 90 top
R60  35.75,36 90 top
R61  17.25,36 90 top
R62  18.75,36 90 top
R63  15.75,36 90 top
R64  14.25,36 90 top
R65  37.25,36 90 top
R66  19.25,87.12 180 top
R67  54.25,58.88 270 top
R68  30.23,77.47 0 top
R69  40.39,96.52 180 top
R70  18.12,82.62 180 top
R71  16.62,79 180 top
R72  56.75,85.38 180 top
R73  32.97,67.28 90 top
SWD1  16.39,55.36 0 bottom
U1  38.75,71.12 180 top
U$1  30.23,25.4 0 top

### Tracks (layer width: path | path; a pad name or v marks a point on that pad's centre or on a via)
3.3V  (via drill 0.3)
  Top 0.305: R51.1 19,71.32 | C14.2 IC5.16 | 32.77,70.77 R68.P$3 32.97,69.81 R73.2 | IC6.10 33.06,35.94 | IC7.10 48.12,42.95 48.12,44.5 49.38,44.5 55.88,38 55.88,26 54.5,24.62 54.5,16.58 R45.P$3 54.38,14 50.25,14 46.12,18.12 43.75,18.12 42.93,18.95 D40.+ | IC7.16 42.39,41.88 | IC5.10 18,44.37 18.37,44.75 | IC9.3 C8.2 | IC6.16 28.88,35 28.62,35.25 | C21.2 30,63.51 30,63.28 30,63.13 | R69.P$3 37.34,103.22 36.62,102.5 32.65,102.5 C10.2 | IC8.16 12.25,85.88 | 12.25,85.88 12.25,85.12 C22.2 | IC8.10 11.31,90.68 v11.38,90.75 | v11.62,85.88 12.25,85.88 | C23.+ 23.12,55.12 23.38,54.88
  Top 0.356: IC10.4 19.99,70.78
  Top 0.4: 48.12,44.5 48.12,45.25 47,46.38 46.5,46.38 46.5,48.48 R20.2
  Top 0.508: C4.2 19.92,69.19 IC10.4 19.38,71.32 19,71.32 v19,71.25 | 19.99,70.78 20.45,71.25 20.45,71.5 21.09,72.14 22.48,72.14 R50.1 23.5,71.12 v23.5,69.75 | IC1.2 30.25,96.88 | 30.25,96.88 IC1.4 32.51,102.54 C10.2 33.02,103.14 C12.+ | 30.25,96.88 27.88,96.88 26.62,95.62 26.62,94.17 26.3,93.8 22.62,90.12 | v21,53.25 21.75,54 21.75,54.88 | 21.75,54.88 21.75,55.5 20.99,56.26 C8.2 | 30,63.13 30,62 | 30,62 29.41,61.41 IC3.1 | 30,63.28 30,68 | v24.5,68.75 25.25,68 30,68 | 33.06,35.94 v33.12,35.88 | 21.12,53.12 v21,53.25 | C14.2 13.51,42.14 v13.75,41.88 | v13.75,44.5 13.75,45.88 13.88,46 | 13.88,46 v15.25,47.38 | v20.5,43.5 19.62,43.5 18.37,44.75 18.25,44.88 18.25,47.12 v18.25,47.38 18.38,47.5 18.38,50.25 21,52.88 v21,53.25 | v29,35.88 29,35.63 28.62,35.25 26.88,35.25 C7.2 26.5,36 v20.5,42 | 46.5,46.38 42.38,46.38 | 42.38,46.38 39,46.38 36.88,48.5 36.88,51.25 33.25,54.88 30,54.88 | 30,54.88 30,62 | 42.39,41.88 arc90 C20.2 42.38,41.99 v42.5,41.62 | v42.38,46.25 42.38,46.38 | 13.88,46 12.75,46 4.88,38.12 4.88,25.75 8,22.62 8,18.11 R44.P$3 9.95,16.32 12.5,18.88 v13.88,18.88 | 30,54.88 v27.62,54.88 | v25.88,54.88 23.38,54.88 21.75,54.88 | v9.62,68.88 9.39,68.88 C17.1 8.75,68.49 IC4.4 v8.75,64.38 | v14.5,69.75 v16,71.25 | R29.1 14.24,61.25 v13.5,61.25 | v12.38,92.75 20.12,92.75 22.62,90.25 22.62,90.12 | v26.75,86.12 27.88,85 27.88,78.5 32.81,73.56 R68.P$3 31.97,69.12 31.38,69.12 30.25,68 30,68 | 22.62,90.12 22.62,89.05 R42.P$3
  Bottom 0.305: v11.38,90.75 11.5,90.75
  Bottom 0.356: v16,71.25 16.07,71.32
  Bottom 0.508: SWD1.1 19.14,53.25 v21,53.25 | v23.5,69.75 v24.5,68.75 | R17.P$3 33.12,39.98 v33.12,35.88 v29,35.88 | v13.75,41.88 v13.75,44.5 | v15.25,47.38 v18.25,47.38 | v20.5,42 v20.5,43.5 | v42.5,41.62 42.38,41.75 v42.38,46.25 | v27.62,54.88 v25.88,54.88 | 16.07,71.32 19,71.32 v19,71.25 | v13.5,61.25 10.62,61.25 8.75,63.12 v8.75,64.38 | v14.5,69.75 13.62,68.88 v9.62,68.88 | v13.88,18.88 17.36,18.88 D3.+ | 11.5,90.75 11.62,90.62 v11.62,85.88 | v12.38,92.75 11.38,91.75 v11.38,90.75 | v26.75,86.12 26.75,87 24.75,89 22.67,89 R42.P$3
12V  (via drill 0.3)
  Top 0.305: 32.39,93.82 IC1.3 | 19.38,14.5 18.86,14.5 R39.2 | 45.51,81.5 C13.+ | v51,68.5 51,68.38
  Top 0.508: C11.2 31.1,90.15 | 31.1,90.15 32.39,91.44 32.39,93.82 | 31.1,90.15 34.48,90.15 43.06,81.56 C13.+ 44.75,82.26 D1.2 | 19.38,14.5 23.38,10.5 23.38,3.75 25.62,1.5 34.75,1.5 37.25,4 R19.2 37.12,14.68 37.12,18.25 47,28.12 50.5,28.12 53.75,31.38 v53.75,38 | v56.25,60.25 58,58.5 58,53.62 55,50.62 55,47 55.62,46.38 55.62,41 v54.88,40.25 | v57.88,61.88 59.25,63.25 59.25,71.25 54.75,75.75 51.38,75.75 49.75,74.12 | v49.75,71.12 49.75,74.12 | 45.51,81.5 46.5,81.5 47.25,80.75 47.25,75.62 48.75,74.12 49.75,74.12 | C18.2 45.86,64.59 IC2.8 50.22,64.59 50.88,65.25 50.88,68.25 51,68.38
  Bottom 0.508: v56.25,60.25 v57.88,61.88 | v53.75,38 54.88,39.12 v54.88,40.25 | v51,68.5 51,69.88 v49.75,71.12
-12V  (via drill 0.3)
  Top 0.305: 51.48,89.38 C5.- | D2.1 48.25,89.38 | R26.1 | 55.88,68.39 C19.2 53.52,68.41 IC2.4
  Top 0.508: D2.1 51,89.38 | 51,89.38 51.48,89.38 | 51,89.38 52.75,91.12 57.5,91.12 58.88,89.75 58.88,74.75 v58.12,74 | 48.25,89.38 46.38,87.5 v45.62,87.5 | v43.75,80.25 R26.1 | v55.88,69.62 55.88,68.39
  Bottom 0.508: v45.62,87.5 45.62,82.12 v43.75,80.25 | v58.12,74 58.12,71.88 v55.88,69.62
ADC_FREQ  (via drill 0.3)
  Top 0.203: C16.2 R22.1 12.56,58 IC4.14 12.56,61.94 12.75,62.12 14.88,62.12 v15,62.25 | v20.88,65.12 20.88,65.25 20.75,65.12 IC9.16
  Bottom 0.203: v20.88,65.12 20.75,65.25 v19,65.25 18,65.25 v15,62.25
ADC_MOD
  Top 0.203: C1.2 R2.1 12.56,68.5 IC4.1 13.54,64.88 14.12,64.88 15.88,63.12 15.88,62.12 15.75,62 15.75,61.5 16.12,61.12 16.75,61.12 16.88,61.25 IC9.21
ADC_NORMAL  (via drill 0.3)
  Top 0.203: IC9.9 24.25,60.75 24.62,60.38 24.62,58.75 26.75,56.62 26.75,53.88 v21.12,48.25 | R44.P$2 7.38,16.16 7.38,22.25 4.25,25.38 4.25,38.5 13,47.25 v13.5,47.25
  Bottom 0.203: v13.5,47.25 14.5,48.25 v21.12,48.25
ADC_PHASE  (via drill 0.3)
  Top 0.203: C9.2 R13.1 3.51,65.5 4.25,65.5 4.6,65.85 IC4.7 4.94,64.69 v4.88,64.62 | IC9.10 24.75,61.25 v25,61 | v6.75,64 7.25,63.5 v12.25,63.5 | v13.25,67.38 14.12,68.25 v16.5,68.25 | v26.5,62.5 27.12,63.12 v27.12,64.88 | v27.12,67.12 v22.38,67.12
  Bottom 0.203: v25,61 v26.5,62.5 | v4.88,64.62 6.12,64.62 v6.75,64 | v12.25,63.5 12.25,66.38 v13.25,67.38 | v27.12,64.88 v27.12,67.12 | v22.38,67.12 21.25,68.25 v16.5,68.25
ADC_PHASED  (via drill 0.3)
  Top 0.203: v28.62,66.12 23.62,66.12 21.75,64.25 21.75,63.21 IC9.14 | R45.P$2 54,16.32 54,25 55.38,26.38 55.38,37.62 49.25,43.75 v49,43.75 | v45.5,47.25 39.62,47.25 37.88,49 37.88,51.5 33.5,55.88 32.12,55.88 31.12,56.88 31.12,61.88 31.62,62.38 32.38,62.38 33.25,63.25 33.25,64.12 v31.25,66.12
  Bottom 0.203: v31.25,66.12 v28.62,66.12 | v49,43.75 48.62,44.12 48.62,45.5 46.88,47.25 v45.5,47.25
ADC_SHAPE  (via drill 0.3)
  Top 0.203: C15.2 R12.1 4.94,58.05 IC4.8 4.94,61.81 v4.88,61.88 | v6.12,62.62 13.25,62.62 13.75,63.12 v13.75,63.88 | IC9.15 21.25,64.5 21.75,65 21.75,66.38 21.38,66.75 v20.88,66.75 | v13.75,65.88 14.62,66.75 v17.38,66.75
  Bottom 0.203: v4.88,61.88 5.38,61.88 v6.12,62.62 | v20.88,66.75 v17.38,66.75 | v13.75,63.88 v13.75,65.88
CLOCK  (via drill 0.3)
  Top 0.203: IC7.11 47.51,43.76 47.62,43.88 47.62,45 46.88,45.75 46.12,45.75 45.62,45.25 38.75,45.25 35,41.5 35,41 | 35,41 35,40 33,38 32.12,38 31.75,37.62 31.75,35.96 IC6.11 | IC5.11 17.51,49.89 v17.62,50 | IC9.1 19.75,57.76 16.38,54.38 16.38,51.25 v15.12,50 | v20.38,49.62 20,49.25 20,47 23.75,43.25 32.12,43.25 34.12,41.25 34.75,41.25 35,41
  Bottom 0.203: v15.12,50 v17.62,50 20,50 v20.38,49.62
CLOCK_2  (via drill 0.3)
  Top 0.203: v22.9,58.39 22.7,58.39 22.32,58.77 IC9.6 | 11.28,89.34 IC8.11 11.18,89.34 9.75,89.34 9.66,89.44 8.8,89.44 8.23,88.87 8.23,85.34 v8.7,84.87 | v9.56,85.72 9.56,85.44 14.32,80.68 14.32,78.68 16.04,76.96 v17.84,76.96
  Bottom 0.203: v22.9,58.39 22.32,58.96 22.32,64.68 23.75,66.11 23.75,67.62 20.5,70.88 20.5,71.88 17.84,74.53 v17.84,76.96 | v9.56,85.72 v8.7,84.87
CPU_RESET  (via drill 0.3)
  Top 0.203: v13.75,58.75 14.25,59.25 R29.2 14.76,60.25 15.75,60.25 16.12,59.88 16.12,59.25 16.5,58.88 17.38,58.88 17.75,59.25 17.75,60.12 17.88,60.25 18.23,60.25 18.24,60.24 IC9.23
  Bottom 0.203: SWD1.10 13.75,56.97 v13.75,58.75
DACCS  (via drill 0.3)
  Top 0.203: IC9.7 23.2,58.92 v24.38,57.75 | v27,59.75 27.39,60.13 IC3.2
  Bottom 0.203: v24.38,57.75 25,57.75 v27,59.75
DACSCK
  Top 0.203: IC9.12 25.5,62.25 26.25,61.5 26.25,59.5 26.89,58.87 IC3.3
DACSDI
  Top 0.203: IC9.11 23.21,61.75 25.25,61.75 25.75,61.25 25.75,58.75 26.91,57.59 IC3.4
GND  (via drill 0.3)
  Top 0.203: C12.- v29.25,104.25 | C10.1 v30.25,102.64 | IC1.1 27.95,95.33 v28,95.38 | Q1.E 43.55,58.05 v43.5,58 | IC3.7 34.13,60.13 v34.38,60.12 | IC3.5 v34.38,57.62 | C21.1 31.46,63.71 v31.5,64.5 | IC10.2 20.86,74.39 v20.83,74.42 | C4.1 21.54,70.52 IC10.5 22.22,70.78 v22.25,70.75 | IC4.5 7.48,67.15 v7.5,67.14 | IC4.3 10.02,64.53 v10.04,64.39 | IC4.10 7.48,59.2 v7.5,59.18 | IC4.11 8.75,59.2 v8.77,59.18 | IC4.12 10.02,59.2 v10.04,59.18 | C13.- 45.45,78.52 v45.42,78.23 | C11.1 28.52,92.39 v28.45,92.46 | C17.2 9.04,69.64 v8.26,69.6 | C8.1 20.49,55 v20.5,55.25 | IC9.4 21.25,60.75 IC9.25 v20.5,60.5 | IC5.8 17,42.25 IC5.17 16.5,42.75 IC5.13 | C14.1 11.99,42.01 v12.25,41.75 | IC7.8 46.88,41.37 IC7.17 46.5,41.75 IC7.13 46.5,44.12 v46.5,44.5 | IC6.8 31.25,34.5 arc-90 IC6.17 arc-90 30.75,35 IC6.13 | C7.1 v26.5,33 | C20.1 41,42.26 v41,41.25 | Q5.E 12.62,14.46 v12.62,13.5 | Q3.E 40.12,15.99 v40.12,14.88 | C22.1 v14.38,84.88 | 54.15,87.64 v54.12,87.62 54.1,87.6 Q2.E | C6.1 v38.5,74.25 | U1.1 40.81,70.19 v40.88,70.12 | v12.75,91.25 IC8.8 12.75,88.88 IC8.17 12.25,88.37 IC8.13 v9.25,88.38 | C19.1 v58.12,68.38 | IC2.3 54.74,67.14 v54.75,67.12 | IC2.5 46.78,68.41 v46.75,68.38 | C18.1 43.99,63.61 v43.88,63.5 | C23.- v23.12,51.88 | C24.2 25.36,40.74 v25.38,40.75
  Top 0.4: R67.1 v54.25,60.62
  Top 0.5: C5.+ 54.15,87.64
  Bottom 0.203: v29.25,104.25 29.25,104.5 | v30.25,102.64 30,102.64 | v28,95.38 27.75,95.63 | v43.5,58 43.5,58.25 | v31.5,64.5 31.25,64.25 | v20.83,74.42 21.34,74.42 | v7.5,67.14 7.5,67.01 | v10.04,64.39 9.91,64.01 | v7.5,59.18 7.5,58.93 | v8.77,59.18 8.77,59.05 | v10.04,59.18 10.04,59.05 9.91,58.93 | v45.42,78.23 45.67,78.36 | v28.45,92.46 28.32,92.46 | v8.26,69.6 8.01,69.6 | v20.5,55.25 20.38,55.12 | v22.25,70.75 22.25,70.5 | v12.25,41.75 12.75,41.5 | 51.25,87.75 51.25,87.62 | v46.5,44.5 46.5,44.38 | v26.5,33 26.25,33 arc90 26.12,32.88 | v41,41.25 40.62,40.88 | v12.62,13.5 12.5,13.5 12.5,13 | v40.12,14.88 40.25,15 40.5,15 | v14.38,84.88 14.62,84.88 | v54.12,87.62 54,87.62 | v38.5,74.25 38.25,74.25 | v40.88,70.12 41,70.12 | v9.25,88.38 10.25,88.38 | v58.12,68.38 58.12,68.62 | v54.75,67.12 55,67.12 | v46.75,68.38 46.62,68.5 | v43.88,63.5 43.88,63.12 | v23.12,51.88 22.88,51.88 | v25.38,40.75 25.5,40.75 25.62,40.88
  Bottom 0.4: v54.25,60.62 53.88,60.62
  other vias: 21.5,61.5 31,34.75 46.75,41.62 16.75,42.5 12.5,88.62
  pour Bottom: -0.89,106.68 -5.33,-2.54 63.25,-1.91 63.25,109.86
KNOB_FREQ  (via drill 0.3)
  Top 0.203: R30.2 14.49,52.24 v13.12,50.88 | 30.25,40.31 R17.P$2 27.89,42.62 24.62,42.62 | 24.62,42.62 23.62,42.62 19.38,46.88 19.38,49.62 v20.62,50.88 | C24.1 24.75,42.5 24.62,42.62
  Bottom 0.203: v13.12,50.88 v20.62,50.88
KNOB_MOD
  Top 0.203: R69.P$2 40.39,101.86 41.12,101.12 45.09,101.12 R27.2
KNOB_PHASE
  Top 0.203: R43.2 5.5,89.01 5.5,90.12 6.5,91.12 9.62,91.12 10.38,91.88 18.25,91.88 20.07,90.06 R42.P$2
KNOB_SHAPE  (via drill 0.3)
  Top 0.203: R68.P$2 30.23,72.02 28.5,73.75 24.62,73.75 23.12,75.25 14.62,75.25 v12.25,72.88 | v10.5,74.38 9.25,75.62 6.12,75.62 3.5,73 3.5,72.38 3.88,72 3.88,70.64 R23.2
  Bottom 0.203: v12.25,72.88 12,72.88 v10.5,74.38
LATCH  (via drill 0.3)
  Top 0.203: IC7.12 47,44 47.12,44.12 47.12,44.88 46.75,45.25 46.25,45.25 45.75,44.75 39.25,44.75 v35.75,41.25 35.75,39.88 33,37.12 v32.38,37.12 | IC6.12 31.25,37.75 v31.12,37.88 | IC5.12 17,45.85 | 17,45.85 17,48.87 v16.62,49.25 | v14,49.25 14,50 14.62,50.62 15.12,50.62 15.88,51.38 15.88,54.12 15.25,54.75 v15.25,59.62 | 17,45.85 16.98,45.88 v16.62,45.88 | v17.5,62.88 17.5,62.62 17.88,62.25 18.75,62.25 IC9.19 | v22.12,45.88 24.12,43.88 32.5,43.88 v34.38,42 | v14.32,77.39 13.94,77.77 13.94,80.49 8.61,85.82 8.61,88.68 8.99,89.06 9.47,89.06 9.66,88.87 11.28,88.87 IC8.12 | v16.38,61.75 16.38,63.75 15.88,64.25 15.88,65.5 v15.38,66
  Bottom 0.203: v32.38,37.12 31.88,37.12 v31.12,37.88 | v16.62,49.25 v14,49.25 | v17.5,62.88 v16.38,61.75 15.25,60.62 v15.25,59.62 | v34.38,42 35.12,41.25 v35.75,41.25 | v16.62,45.88 v22.12,45.88 | v14.32,77.39 14.89,76.82 14.89,75.72 14.88,75.62 14.32,75.07 14.38,75.02 14.38,71.25 15.88,69.75 15.88,69.62 15.38,69.12 v15.38,66
N$1
  Top 0.203: R33.2 12.75,39.75 11,41.5 11,43.25 11.5,43.75 15.45,43.75 IC5.15
N$3
  Top 0.203: R16.2 2.25,72.6 7.37,77.72 J2.TIP@3
N$4
  Top 0.203: C15.1 R12.2 6.21,58.3 IC4.9 6.21,61.54 5.25,62.5 3.51,62.5 R15.1 2.71,61.72 1.15,61.72 0.89,61.98 0.89,66.8 2.25,68.16 R16.1 R23.1
N$5
  Top 0.203: IC3.8 36.39,61.41 R9.2
N$6
  Top 0.203: J3.TIP@3 50.38,103.77 R1.2
N$7
  Top 0.203: IC3.6 36.1,58.87 R7.2
N$8
  Top 0.203: IC4.2 11.24,65.85 R2.2 C1.1 R3.1 11.24,72.83 12.83,74.43 12.83,81.03 9.66,84.2 3.31,84.2 1.02,86.49 1.02,99.19 7.37,105.54 44.71,105.54 46.24,104 R27.1 46.15,103.71 R1.1
N$9
  Top 0.203: R9.1 37.75,62.5 42.25,67 43.49,67 R5.2 C2.1 | IC2.6 45.75,67.14 C2.1 | R37.1 45.61,67.49 C2.1
N$10
  Top 0.203: C3.1 R8.2 55.48,65.86 IC2.2 53.34,65.88 52.12,65.88 51.75,66.25 51.75,69 50.64,70.11 R36.1 46.74,70.88 44.5,70.88 43.62,70 43.62,69 37,62.38 37,60.62 37.64,59.99 R7.1
N$11
  Top 0.203: J4.TIP@3 7.37,96.62 2.5,91.75 R11.2
N$12  (via drill 0.3)
  Top 0.203: R41.1 C9.1 R13.2 3.51,64 5.25,64 6.21,64.96 IC4.6 6.21,70.92 v4.38,72.75 | R11.1 3.5,88.99 | 3.5,88.99 3.98,88.99 R43.1 | v2.88,74.25 1.62,75.5 1.62,83.88 v1.88,84.12 | v3.25,85.5 3.25,88.74 3.5,88.99
  Bottom 0.203: v4.38,72.75 v2.88,74.25 | v1.88,84.12 v3.25,85.5
N$13  (via drill 0.3)
  Top 0.508: D1.1 48.75,86.88 v49.38,87.5
  Bottom 0.305: v49.38,87.5 v49.37,87.5
  Bottom 0.508: J14.10 v49.37,87.5 J14.9
N$14
  Top 0.203: R47.1 44.75,31.72 D7.+
N$15
  Top 0.203: Q1.B 46.63,57.73 R18.2
N$16
  Top 0.203: J5.TIP@3 53.09,57.03 52.39,57.73 R18.1
N$19
  Top 0.203: IC5.1 15.05,37.56 R64.2
N$20
  Top 0.203: J13.TIP@3 55.39,12.12 R25.1
N$21
  Top 0.203: J12.TIP@3 7.38,7.75 11.36,3.77 R24.1
N$22
  Top 0.203: R63.2 15.75,38.75 15.5,39 IC5.2
N$23
  Top 0.203: R10.1 44.86,20.38 42.75,20.38 41.88,19.5 41.88,17.57 D40.-
N$25  (via drill 0.3)
  Top 0.203: v40,19.5 41.75,21.25 R21.2 | Q3.B 38.12,16.22 v38.12,17.25
  Bottom 0.203: v38.12,17.25 40,19.12 v40,19.5
N$26
  Top 0.203: IC5.3 15.99,39.76 17.25,38.5 R61.2
N$27
  Top 0.203: D3.- 17.53,16.53 19.62,18.62 19.62,21.99 R35.1
N$28
  Top 0.203: D28.+ 23.25,23.43 23.25,26.5 18.75,31 R62.1
N$29
  Top 0.203: J7.TIP@3 41,14.05 R19.1 39.24,14.51 Q3.C
N$30
  Top 0.203: IC5.4 16.5,40 18.75,37.75 R62.2
N$31
  Top 0.203: IC5.5 17,40.25 19.5,37.75 20,37.75 20.25,37.5 R57.2
N$32
  Top 0.203: R61.1 17.25,31.75 20.64,28.36 D29.+
N$33
  Top 0.203: J1.TIP@3 10.36,53.4 11.5,52.25 13.15,52.25 R14.2
N$34
  Top 0.203: R28.1 C16.1 | C16.1 R22.2 11.29,58 IC4.13 | C16.1 10.99,54.76 12,53.75 13.93,53.75 R14.1 15.04,53.74 R30.1
N$35
  Top 0.203: IC5.6 17.51,40.49 19.75,38.25 20.26,38.25 R56.2
N$36
  Top 0.203: IC5.7 18,40.76 20,38.75 21.26,38.75 R58.2
N$37
  Top 0.203: IC6.3 30.24,32.61 29.88,32.25 26,32.25 25.5,32.75 25.51,32.75 R59.2
N$38
  Top 0.203: IC7.7 47.99,37.01 R54.2
N$39
  Top 0.203: IC7.6 47.51,38.02 R55.2
N$40
  Top 0.203: IC7.5 47,38.88 46.12,38 45.38,38 44.75,37.38 R47.2
N$41
  Top 0.203: R38.1 30.17,28.16 U$1.LEDPOS
N$42
  Top 0.203: R70.1 21.44,82.62 D13.+
N$43
  Top 0.203: IC7.4 46.5,39.25 45.88,38.62 45.11,38.62 R46.2
N$44
  Top 0.203: Q2.B 55.04,84.42 R72.2
N$45
  Top 0.203: J8.TIP@3 55.59,81.97 57.5,83.88 57.5,85.36 R72.1
N$46
  Top 0.203: R46.1 43.25,33.88 39.88,30.5 39.88,27 D6.+
N$47
  Top 0.203: R48.1 41.75,34.25 37,29.5 37,23.22 D5.+
N$48
  Top 0.203: R49.1 40.25,34.75 35.75,30.25 35.75,20.03 D4.+
N$49
  Top 0.203: R55.1 46.25,33.14 D8.+
N$50
  Top 0.203: 47.75,35.22 R54.1 50.27,35.24 D9.+
N$51
  Top 0.203: R60.1 35.75,34 34.25,32.5 34.25,21.5 31.88,19.12 31.88,7.25 33.02,6.11 D10.+
N$52
  Top 0.203: D11.+ 32.38,11.05 32.38,18.88 34.75,21.25 34.75,32 37.25,34.5 R65.1
N$53
  Top 0.203: IC7.3 45.99,39.61 45.5,39.12 44.11,39.12 R48.2
N$54
  Top 0.203: IC7.2 43.92,40.43 R49.2
N$55
  Top 0.203: IC7.1 43.36,41.37 R32.2
N$56
  Top 0.203: IC7.15 39.32,42.82 37.25,40.75 R65.2
N$57
  Top 0.203: IC6.7 33.43,33.56 34.75,34.88 34.75,35.76 R60.2
N$58
  Top 0.203: R71.1 17.42,79.03 20.1,79.03 D14.+
N$59
  Top 0.203: IC8.1 12.75,86 13,85.75 14.38,85.75 15.12,85 15.12,80 15.86,79.26 R71.2
N$60
  Top 0.203: R40.2 14.86,18.24 Q5.B
N$61
  Top 0.203: J6.TIP@3 17.53,14.25 R39.1 16.38,15.4 Q5.C
N$62
  Top 0.203: IC8.2 13.75,87.32 13.75,86.75 14.12,86.38 14.75,86.38 15.62,85.5 15.62,84.36 R70.2
N$64  (via drill 0.3)
  Top 0.508: D2.2 v38.38,89.38
  Bottom 0.508: J14.2 39.21,89.38 | 39.21,89.38 J14.1 | v38.38,89.38 39.21,89.38
N$65
  Top 0.203: R66.1 22.38,87.12 23.38,88.12 27.12,88.12 28.25,89.25 34.12,89.25 39.09,84.28 D12.+
N$66
  Top 0.203: IC8.3 13.71,87.88 14.88,87.88 16.25,86.5 16.25,85.24 R31.2
N$67
  Top 0.203: IC8.4 15.25,88.38 17.36,86.26 R34.2
N$68
  Top 0.203: IC8.5 15.62,88.88 17.38,87.12 R66.2
N$73
  Top 0.203: D27.+ 24.75,19.99 24.75,25.75 20.25,30.25 R57.1
N$74
  Top 0.203: D26.+ 27,15.37 27,19.5 25.25,21.25 25.25,26 21.75,29.5 R56.1
N$75
  Top 0.203: D25.+ 28,10.96 28,19.25 25.75,21.5 25.75,26.25 23.25,28.75 R58.1
N$76
  Top 0.203: D24.+ 29,7.5 29,19 26.25,21.75 26.25,26.5 24.75,28 R59.1
N$77
  Top 0.203: R63.1 15.75,31.68 D30.+
N$78
  Top 0.203: R64.1 14.25,33.28 D31.+
N$79
  Top 0.203: R33.1 10.19,35.24 D32.+
N$80
  Top 0.203: D33.+ 33.5,15.08 33.5,19.25 35.25,21 35.25,31.5 38.75,35 R32.1
N$81
  Top 0.203: R31.1 20.91,84.12 23.66,86.88 29.36,86.88 D34.+
N$82
  Top 0.203: R34.1 21.62,85.62 23.5,87.5 27.62,87.5 28.88,88.75 32.9,88.75 D35.+
NORMALOUT
  Top 0.203: R24.2 13.54,0.88 53.25,0.88 59.12,6.75 59.12,17.75 55.5,21.38 55.5,24 59.25,27.75 59.25,59.38 57.12,61.5 C3.2 R8.1 55.27,64.59 IC2.1
OUT_LFOCYCLEMID  (via drill 0.3)
  Top 0.203: IC6.5 31.25,31.88 30.94,31.56 30.94,29.5 31.5,28.94 31.5,27 31.12,26.62 31.12,24 31.5,23.62 31.5,20.25 30.88,19.62 30.88,3.25 32,2.12 34.12,2.12 v35.75,3.75 | v37,2.5 37.75,2.5 45.5,10.12 45.5,16.5 v45.88,16.88 | 43.27,21.4 R21.1 45.21,21.55 R10.2 45.26,21.5 46.38,21.5 47.62,20.25 v47.62,18.62
  Bottom 0.203: v35.75,3.75 v37,2.5 | v45.88,16.88 v47.62,18.62
OUT_LFOCYCLESTART  (via drill 0.3)
  Top 0.203: R40.1 R35.2 18.11,26.61 v19.62,28.12 | v25.75,30.25 27.25,31.75 30.25,31.75 30.75,32.25 IC6.4
  Bottom 0.203: v19.62,28.12 21.88,30.38 25.62,30.38 v25.75,30.25
PHASEDOUT
  Top 0.203: R25.2 57.93,18.2 55,21.12 55,24.25 58.75,28 58.62,58.86 58.62,59 56.5,61.12 56.5,62 56,62.5 43.38,62.5 42.62,63.25 42.62,65.25 43.24,65.86 R5.1 C2.2 | IC2.7 C2.2 | C2.2
REF_-5V  (via drill 0.3)
  Top 0.203: R15.2 R41.2 2.04,60.95 2.04,59.88 | R28.2 7.99,55.74 7.5,55.24 3.69,55.24 2.04,56.9 2.04,59.88 | R3.2 12.26,71 v12.25,71 | v5.5,70.38 5,69.88 5,68.38 3.5,66.88 v2.75,66.88 | v2.62,59.88 2.04,59.88 | v12.12,74.75 10,72.62 v10,70.38 | 45.5,74.11 R26.2 43.61,74.25 C6.2 40.75,74.24 40.75,72.88 39.94,72.06 U1.2 37.69,72.06 v36.62,73.12 | 45.5,74.11 46.89,74.11 47.5,73.5 R36.2 | v13.5,76.12 13.88,75.75 23.5,75.75 24.88,74.38 29.12,74.38 30.38,73.12 v31.5,73.12 | R37.2 45.61,74.01 45.5,74.11
  Bottom 0.203: v12.25,71 11.62,70.38 v10,70.38 v5.5,70.38 | v2.75,66.88 2.62,66.75 v2.62,59.88 | v12.12,74.75 v13.5,76.12 | v31.5,73.12 v36.62,73.12
RESET_PATTERN  (via drill 0.3)
  Top 0.203: IC9.20 18.79,61.75 17.62,61.75 16.88,62.5 16.88,64.88 18.25,66.25 18.25,67.5 16.88,68.88 14.5,68.88 13.88,69.5 13.88,70 14.5,70.62 14.5,74.25 14.88,74.62 v16.12,74.62 | Q1.C 45.36,51.25 R20.1 45.55,51.2 47.12,49.62 47.12,47.88 v52.5,42.38 | U$1.1 32.77,27.39 31.62,26.25 31.62,24.38 32.77,23.23 | 32.77,23.23 U$1.2 | 32.77,23.23 32.75,23.21 32.75,20.75 31.38,19.38 31.38,5.88 32.5,4.75 33.88,4.75 36.38,7.25 36.38,18.5 46.75,28.88 50,28.88 53,31.88 53,37.5 50.75,39.75 v50.75,40.75 | Q1.C 44.83,56.38 | v30,75 25.12,75 23.75,76.38 v16.38,76.38 | v31.25,76.38 34.38,73.25 34.38,67.75 v37.88,64.25 | v39.38,62.75 39.38,60.38 43.38,56.38 45.38,56.38 45.36,56.36 Q1.C
  Bottom 0.203: v50.75,40.75 v52.5,42.38 | v31.25,76.38 v30,75 | v37.88,64.25 v39.38,62.75 | v16.12,74.62 16.12,76.12 v16.38,76.38
RETURNGROUND  (via drill 0.3)
  Top 0.356: R67.2 55.39,58.11 v57,56.5 | v3.25,1 3.25,7.2 J12.RING@3
  Bottom 0.356: v57,56.5 59.12,54.38 59.12,27.75 55.38,24 55.38,21.25 59,17.62 59,3.88 55.88,0.75 49.25,0.75 | 49.25,0.75 3.5,0.75 v3.25,1 | J13.RING@3 49.39,0.89 49.25,0.75
SCL
  Top 0.203: IC10.1 22.43,72.75 R50.2 24.75,71.39 24.75,70 22.75,68 20.75,68 20.24,67.49 IC9.17
SDA
  Top 0.203: IC10.3 19.66,73.37 19.18,72.9 18.31,72.9 R51.2 17.25,71.84 17.25,70 19.75,67.5 IC9.18
SHIFTER1TO2
  Top 0.203: IC5.9 21,42.75 26.12,37.62 29.75,37.62 30.25,37.12 30.25,35.96 IC6.14
SHIFTERS
  Top 0.203: IC9.2 20.24,57.49 17,54.25 17,51 16,50 16,43.71 IC5.14
SHIFTERS2TO3
  Top 0.203: IC7.14 45.99,44.01 45.75,44.25 39.62,44.25 36.38,41 36.38,39.62 34.12,37.38 34.12,35.62 33.5,35 IC6.9
SHIFTERS_2  (via drill 0.3)
  Top 0.203: v19.5,77.62 17.66,77.63 15.94,77.63 14.7,78.87 14.7,80.87 10.61,84.96 10.61,87.72 10.7,87.82 11.28,87.82 IC8.14 | v19.5,74.62 18.88,74.62 16.8,72.68 16.8,69.53 18.7,67.63 18.7,65.82 18.32,65.44 18.31,65.44 18.25,65.38 18.25,64.5 18.95,63.8 v18.95,63.71 | v21.47,57.63 21.47,57.82 21.75,58.1 21.75,58.77 IC9.5
  Bottom 0.203: v19.5,74.62 v19.5,77.62 | v18.95,63.71 18.95,60.15 v21.47,57.63
SWD_CLK  (via drill 0.3)
  Top 0.203: IC9.22 17.25,60.75 16.88,60.38 v16.88,59.75
  Bottom 0.203: SWD1.4 17.75,56.95 17.75,59 17.62,59 v16.88,59.75
SWD_DIO  (via drill 0.3)
  Top 0.203: IC9.24 19,59.55 v19,59
  Bottom 0.203: v19,59 18.93,58.94 SWD1.2
SYNC_LFO  (via drill 0.3)
  Top 0.203: IC9.13 22.3,63.25 23.88,63.25 26.12,65.5 29,65.5 29.25,65.75 29.25,66.88 v29,67.12 | Q2.C 51.25,85.38 v47.62,81.75 | v31.5,67.75 32.74,66.51 R73.1 34.14,66.51 v34.38,66.75 | v42.62,78.38 40,75.75 37.75,75.75 35.38,73.38 v35.38,67.88
  Bottom 0.203: v47.62,81.75 47.12,81.75 43.75,78.38 v42.62,78.38 | v31.5,67.75 29.62,67.75 v29,67.12 | v34.38,66.75 34.38,66.88 v35.38,67.88
TRIGGERBUTTONLED
  Top 0.203: IC6.6 31.76,30.76 R38.2

### Text on the board
tNames: U$1